# EAGLE design arpie-fullsize (EAGLE 6.4)

## Sheet 1 of 2
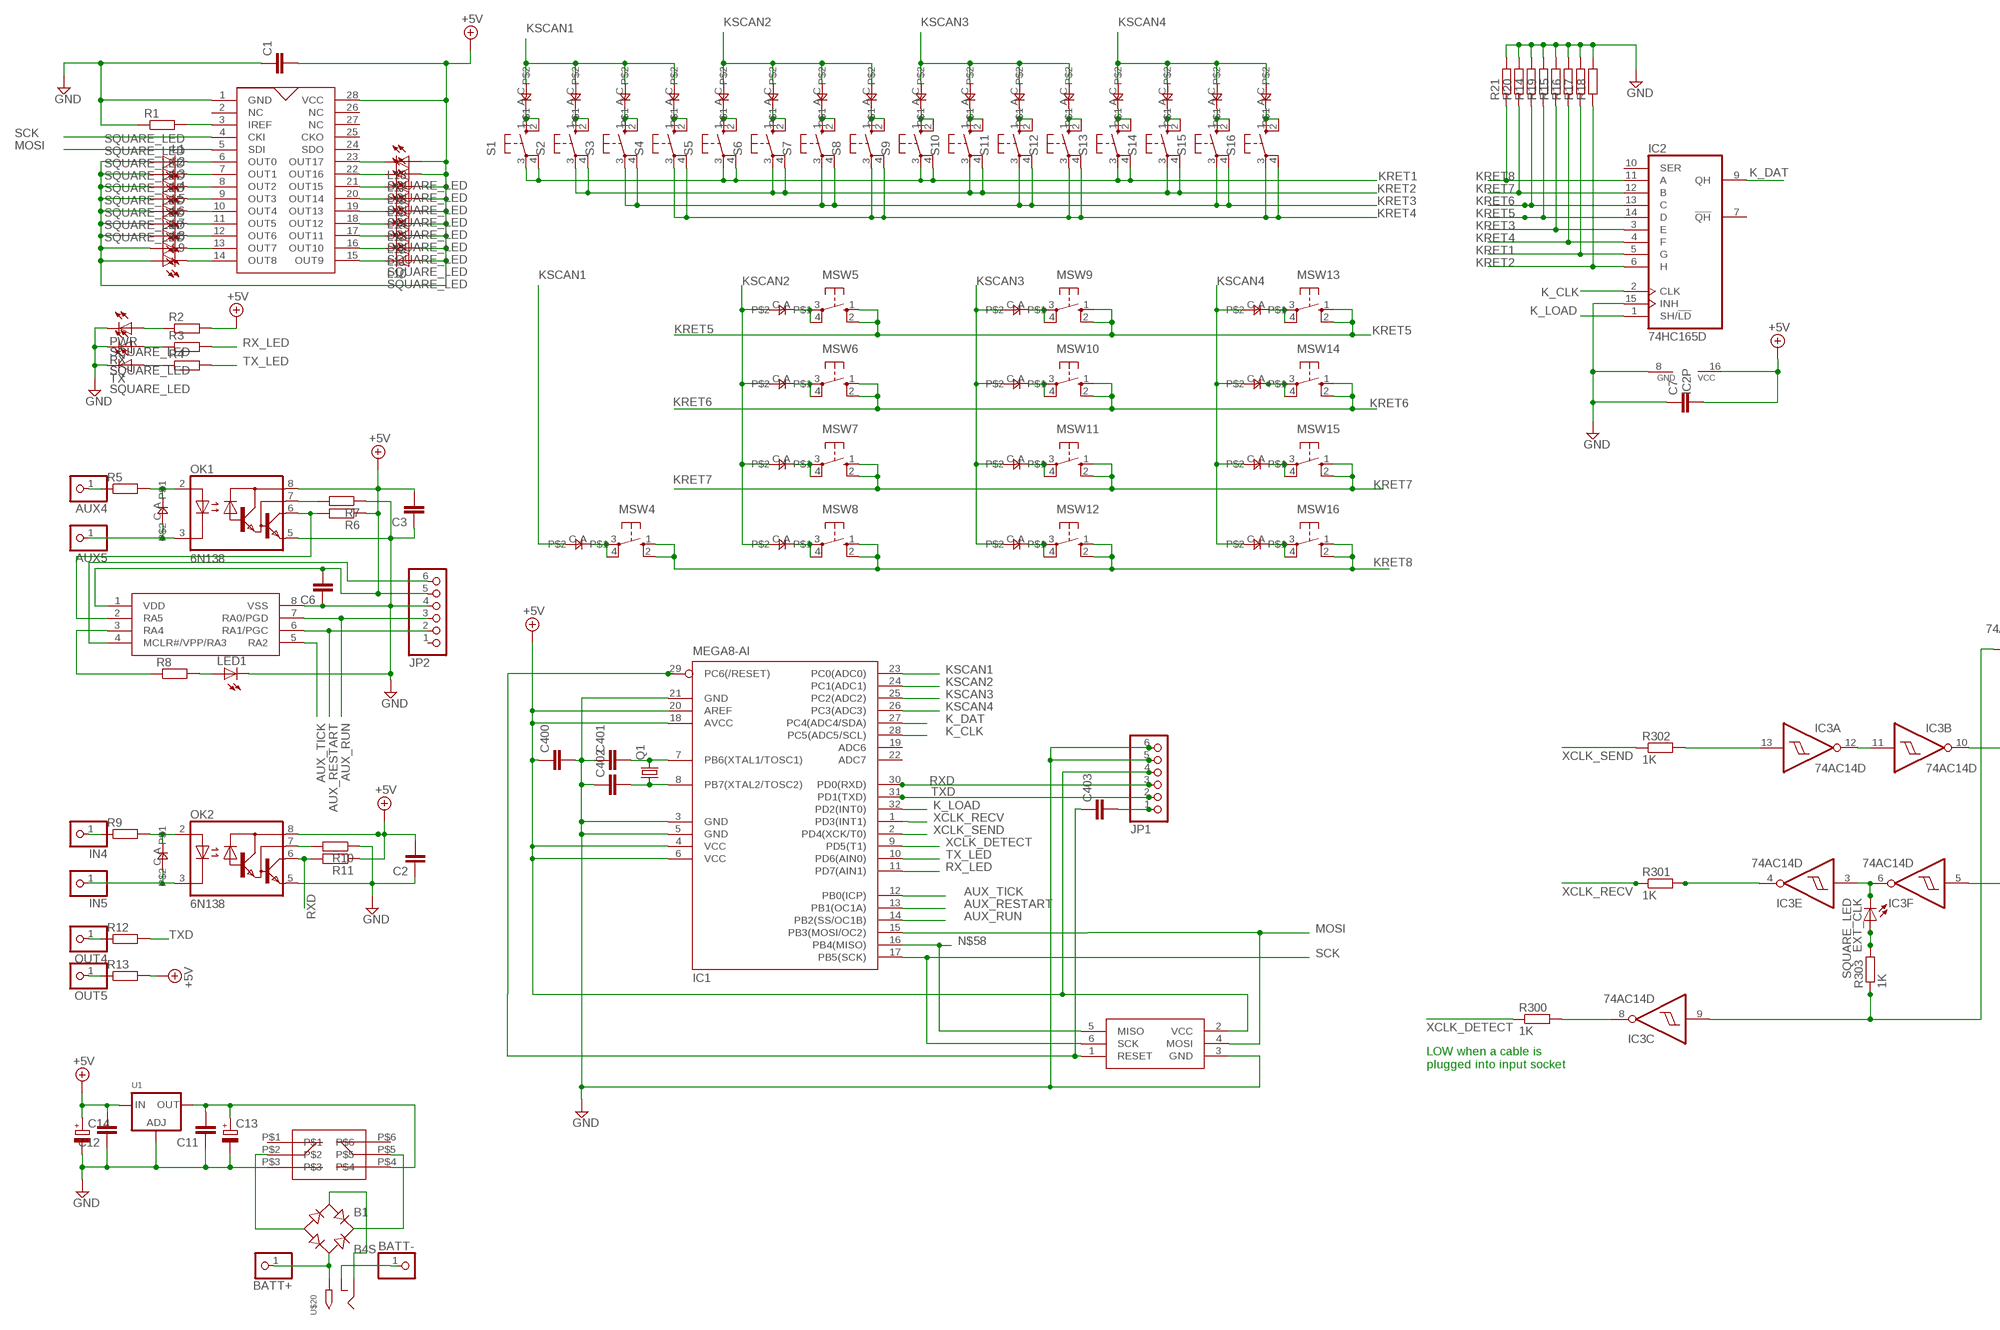
[diagram p0: schematic, sheet 1, part 1 of 2]
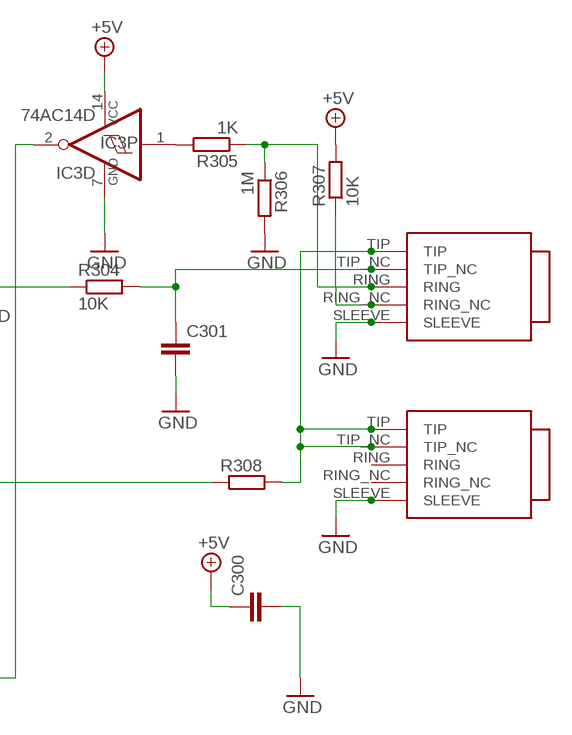
[diagram p1: schematic, sheet 1, part 2 of 2]

### Parts
AUX4  PINHD-1X1  [1X01]
AUX5  PINHD-1X1  [1X01]
B1  B4S  [MBS]
BATT+  PINHD-1X1  [1X01]
BATT-  PINHD-1X1  [1X01]
C1  C-EUC0805  [C0805]
C2  C-EUC0805  [C0805]
C3  C-EUC0805  [C0805]
C6  C-EUC0805  [C0805]
C7  C-EUC0805  [C0805]
C11  C-EUC0805  [C0805]
C12  C-EUC0805  [C0805]
C13  CPOL-EUE2-5  [E2-5]
C14  CPOL-EUE2-5  [E2-5]
C300  C-EUC0805  [C0805]
C301  C-EUC0805  [C0805]
C400  C-EUC0805  [C0805]
C401  C-EUC0805  [C0805]
C402  C-EUC0805  [C0805]
C403  C-EUC0805  [C0805]
EXT_CLK  SQUARE_LED  [RECT_LED]
IC1  MEGA8-AI  [TQFP32-08]
IC2  74HC165D  [SO16]
IC3  74AC14D  [SO14]
IN4  PINHD-1X1  [1X01]
IN5  PINHD-1X1  [1X01]
JP1  PINHD-1X6  [1X06]
JP2  PINHD-1X6  [1X06]
L1  SQUARE_LED  [RECT_LED]
L2  SQUARE_LED  [RECT_LED]
L3  SQUARE_LED  [RECT_LED]
L4  SQUARE_LED  [RECT_LED]
L5  SQUARE_LED  [RECT_LED]
L6  SQUARE_LED  [RECT_LED]
L7  SQUARE_LED  [RECT_LED]
L8  SQUARE_LED  [RECT_LED]
L9  SQUARE_LED  [RECT_LED]
L10  SQUARE_LED  [RECT_LED]
L11  SQUARE_LED  [RECT_LED]
L12  SQUARE_LED  [RECT_LED]
L13  SQUARE_LED  [RECT_LED]
L14  SQUARE_LED  [RECT_LED]
L15  SQUARE_LED  [RECT_LED]
L16  SQUARE_LED  [RECT_LED]
L17  SQUARE_LED  [RECT_LED]
L18  SQUARE_LED  [RECT_LED]
LED1  LEDCHIP-LED0805  [CHIP-LED0805]
MSW4  40-XX  [B3F-40XX]
MSW5  40-XX  [B3F-40XX]
MSW6  40-XX  [B3F-40XX]
MSW7  40-XX  [B3F-40XX]
MSW8  40-XX  [B3F-40XX]
MSW9  40-XX  [B3F-40XX]
MSW10  40-XX  [B3F-40XX]
MSW11  40-XX  [B3F-40XX]
MSW12  40-XX  [B3F-40XX]
MSW13  40-XX  [B3F-40XX]
MSW14  40-XX  [B3F-40XX]
MSW15  40-XX  [B3F-40XX]
MSW16  40-XX  [B3F-40XX]
OK1  6N138  [DIL08]
OK2  6N138  [DIL08]
OUT4  PINHD-1X1  [1X01]
OUT5  PINHD-1X1  [1X01]
PWR  SQUARE_LED  [RECT_LED]
Q1  CRYSTALHC49U-V  [HC49U-V]
R1  R-EU_R0805  [R0805]
R2  R-EU_R0805  [R0805]
R3  R-EU_R0805  [R0805]
R4  R-EU_R0805  [R0805]
R5  R-EU_R0805  [R0805]
R6  R-EU_R0805  [R0805]
R7  R-EU_R0805  [R0805]
R8  R-EU_R0805  [R0805]
R9  R-EU_R0805  [R0805]
R10  R-EU_R0805  [R0805]
R11  R-EU_R0805  [R0805]
R12  R-EU_R0805  [R0805]
R13  R-EU_R0805  [R0805]
R14  R-EU_R0805  [R0805]
R15  R-EU_R0805  [R0805]
R16  R-EU_R0805  [R0805]
R17  R-EU_R0805  [R0805]
R18  R-EU_R0805  [R0805]
R19  R-EU_R0805  [R0805]
R20  R-EU_R0805  [R0805]
R21  R-EU_R0805  [R0805]
R300  1K  R-EU_R0805  [R0805]
R301  1K  R-EU_R0805  [R0805]
R302  1K  R-EU_R0805  [R0805]
R303  1K  R-EU_R0805  [R0805]
R304  10K  R-EU_R0805  [R0805]
R305  1K  R-EU_R0805  [R0805]
R306  1M  R-EU_R0805  [R0805]
R307  10K  R-EU_R0805  [R0805]
R308  R-EU_R0805  [R0805]
RX  SQUARE_LED  [RECT_LED]
S1  10-XX  [B3F-10XX]
S2  10-XX  [B3F-10XX]
S3  10-XX  [B3F-10XX]
S4  10-XX  [B3F-10XX]
S5  10-XX  [B3F-10XX]
S6  10-XX  [B3F-10XX]
S7  10-XX  [B3F-10XX]
S8  10-XX  [B3F-10XX]
S9  10-XX  [B3F-10XX]
S10  10-XX  [B3F-10XX]
S11  10-XX  [B3F-10XX]
S12  10-XX  [B3F-10XX]
S13  10-XX  [B3F-10XX]
S14  10-XX  [B3F-10XX]
S15  10-XX  [B3F-10XX]
S16  10-XX  [B3F-10XX]
TX  SQUARE_LED  [RECT_LED]
U1  LM1117SOT223-REFLOW  [SOT223-R]
U$1  WS2803  [SO28W]
U$2  0805DIODE  [0805DIODE]
U$3  0805DIODE  [0805DIODE]
U$4  0805DIODE  [0805DIODE]
U$5  0805DIODE  [0805DIODE]
U$6  0805DIODE  [0805DIODE]
U$7  0805DIODE  [0805DIODE]
U$8  0805DIODE  [0805DIODE]
U$9  0805DIODE  [0805DIODE]
U$10  0805DIODE  [0805DIODE]
U$11  0805DIODE  [0805DIODE]
U$12  0805DIODE  [0805DIODE]
U$13  0805DIODE  [0805DIODE]
U$14  0805DIODE  [0805DIODE]
U$15  0805DIODE  [0805DIODE]
U$16  0805DIODE  [0805DIODE]
U$17  0805DIODE  [0805DIODE]
U$18  TRUCONNECTJACK  [TRUCONNECTJACK]
U$19  TRUCONNECTJACK  [TRUCONNECTJACK]
U$20  2.1MMJACKTHM  [PJ-102A]
U$21  0805DIODE  [0805DIODE]
U$22  0805DIODE  [0805DIODE]
U$23  0805DIODE  [0805DIODE]
U$24  0805DIODE  [0805DIODE]
U$25  0805DIODE  [0805DIODE]
U$26  0805DIODE  [0805DIODE]
U$27  0805DIODE  [0805DIODE]
U$28  0805DIODE  [0805DIODE]
U$29  0805DIODE  [0805DIODE]
U$30  0805DIODE  [0805DIODE]
U$31  0805DIODE  [0805DIODE]
U$32  0805DIODE  [0805DIODE]
U$33  0805DIODE  [0805DIODE]
U$34  TAG_CONN_AVR  [TC2030-MCP-NL]
U$35  PIC12F1822SO08  [SO08]
U$36  0805DIODE  [0805DIODE]
U$37  0805DIODE  [0805DIODE]
U$38  2P2T_LATCHING  [2P2T_LATCHING]

### Nets
+5V: C1.2 C2.2 C3.2 C6.2 C7.2 C12.2 C14.+ C300.1 C400.1 IC1.4(VCC) IC1.6(VCC) IC1.18(AVCC) IC1.20(AREF) IC2.16(VCC) IC3.14(P:VCC) JP1.4 JP2.5 L1.AN(A) L2.AN(A) L3.AN(A) L4.AN(A) L5.AN(A) L6.AN(A) L7.AN(A) L8.AN(A) L9.AN(A) L10.AN(A) L11.AN(A) L12.AN(A) L13.AN(A) L14.AN(A) L15.AN(A) L16.AN(A) L17.AN(A) L18.AN(A) OK1.8(VCC) OK2.8(VCC) R2.2 R6.1 R11.1 R13.2 R307.2 U1.3(IN) U$1.28(VCC) U$34.2(VCC) U$35.1(VDD)
AUX_RESTART: IC1.13(PB1(OC1A)) JP2.2 U$35.6(RA1/PGC)
AUX_RUN: IC1.14(PB2(SS/OC1B)) JP2.3 U$35.7(RA0/PGD)
AUX_TICK: IC1.12(PB0(ICP)) U$35.5(RA2)
GND: C1.1 C2.1 C3.1 C6.1 C7.1 C11.1 C12.1 C13.- C14.- C300.2 C301.2 C400.2 C401.1 C402.1 IC1.3(GND) IC1.5(GND) IC1.21(GND) IC2.8(GND) IC2.15(INH) IC3.7(P:GND) JP1.5 JP1.6 JP2.4 LED1.C OK1.5(GND) OK2.5(GND) PWR.CA(C) R1.1 R7.1 R10.1 R14.2 R15.2 R16.2 R17.2 R18.2 R19.2 R20.2 R21.2 R306.2 RX.CA(C) TX.CA(C) U1.1(ADJ) U$1.1(GND) U$18.SLEEVE U$19.SLEEVE U$34.3(GND) U$35.8(VSS) U$38.P$3
K_CLK: IC1.28(PC5(ADC5/SCL)) IC2.2(CLK)
K_DAT: IC1.27(PC4(ADC4/SDA)) IC2.9(QH)
K_LOAD: IC1.32(PD2(INT0)) IC2.1(SH/!LD)
KRET1: IC2.5(G) R17.1 S1.3(P) S1.4(P1) S5.3(P) S5.4(P1) S9.3(P) S9.4(P1) S13.3(P) S13.4(P1)
KRET2: IC2.6(H) R18.1 S2.3(P) S2.4(P1) S6.3(P) S6.4(P1) S10.3(P) S10.4(P1) S14.3(P) S14.4(P1)
KRET3: IC2.3(E) R15.1 S3.3(P) S3.4(P1) S7.3(P) S7.4(P1) S11.3(P) S11.4(P1) S15.3(P) S15.4(P1)
KRET4: IC2.4(F) R16.1 S4.3(P) S4.4(P1) S8.3(P) S8.4(P1) S12.3(P) S12.4(P1) S16.3(P) S16.4(P1)
KRET5: IC2.14(D) MSW5.1(S) MSW5.2(S1) MSW9.1(S) MSW9.2(S1) MSW13.1(S) MSW13.2(S1) R19.1
KRET6: IC2.13(C) MSW6.1(S) MSW6.2(S1) MSW10.1(S) MSW10.2(S1) MSW14.1(S) MSW14.2(S1) R14.1
KRET7: IC2.12(B) MSW7.1(S) MSW7.2(S1) MSW11.1(S) MSW11.2(S1) MSW15.1(S) MSW15.2(S1) R20.1
KRET8: IC2.11(A) MSW4.1(S) MSW4.2(S1) MSW8.1(S) MSW8.2(S1) MSW12.1(S) MSW12.2(S1) MSW16.1(S) MSW16.2(S1) R21.1
KSCAN1: IC1.23(PC0(ADC0)) U$2.C U$3.C U$4.C U$5.C U$21.C
KSCAN2: IC1.24(PC1(ADC1)) U$6.C U$7.C U$8.C U$9.C U$22.C U$23.C U$24.C U$25.C
KSCAN3: IC1.25(PC2(ADC2)) U$10.C U$11.C U$12.C U$13.C U$26.C U$27.C U$28.C U$29.C
KSCAN4: IC1.26(PC3(ADC3)) U$14.C U$15.C U$16.C U$17.C U$30.C U$31.C U$32.C U$33.C
MOSI: IC1.15(PB3(MOSI/OC2)) U$1.5(SDI) U$34.4(MOSI)
N$1: L1.CA(C) U$1.6(OUT0)
N$2: L2.CA(C) U$1.7(OUT1)
N$3: L3.CA(C) U$1.8(OUT2)
N$4: L4.CA(C) U$1.9(OUT3)
N$5: L5.CA(C) U$1.10(OUT4)
N$6: L6.CA(C) U$1.11(OUT5)
N$7: L7.CA(C) U$1.12(OUT6)
N$8: L8.CA(C) U$1.13(OUT7)
N$9: L9.CA(C) U$1.14(OUT8)
N$10: L18.CA(C) U$1.23(OUT17)
N$11: L17.CA(C) U$1.22(OUT16)
N$12: L16.CA(C) U$1.21(OUT15)
N$13: L15.CA(C) U$1.20(OUT14)
N$14: L14.CA(C) U$1.19(OUT13)
N$15: L13.CA(C) U$1.18(OUT12)
N$16: L12.CA(C) U$1.17(OUT11)
N$17: L11.CA(C) U$1.16(OUT10)
N$18: L10.CA(C) U$1.15(OUT9)
N$19: S1.1(S) S1.2(S1) U$2.A
N$20: S2.1(S) S2.2(S1) U$3.A
N$21: R1.2 U$1.3(IREF)
N$22: S3.1(S) S3.2(S1) U$4.A
N$23: S4.1(S) S4.2(S1) U$5.A
N$24: S5.1(S) S5.2(S1) U$6.A
N$25: S6.1(S) S6.2(S1) U$7.A
N$26: S7.1(S) S7.2(S1) U$8.A
N$27: S8.1(S) S8.2(S1) U$9.A
N$28: S9.1(S) S9.2(S1) U$10.A
N$29: S10.1(S) S10.2(S1) U$11.A
N$30: S11.1(S) S11.2(S1) U$12.A
N$31: S12.1(S) S12.2(S1) U$13.A
N$32: S13.1(S) S13.2(S1) U$14.A
N$33: S14.1(S) S14.2(S1) U$15.A
N$34: S15.1(S) S15.2(S1) U$16.A
N$35: S16.1(S) S16.2(S1) U$17.A
N$36: MSW13.3(P) MSW13.4(P1) U$30.A
N$38: MSW14.3(P) MSW14.4(P1) U$31.A
N$39: MSW16.3(P) MSW16.4(P1) U$33.A
N$40: MSW15.3(P) MSW15.4(P1) U$32.A
N$43: MSW4.3(P) MSW4.4(P1) U$21.A
N$44: MSW5.3(P) MSW5.4(P1) U$22.A
N$45: MSW6.3(P) MSW6.4(P1) U$23.A
N$46: MSW7.3(P) MSW7.4(P1) U$24.A
N$47: MSW8.3(P) MSW8.4(P1) U$25.A
N$48: MSW9.3(P) MSW9.4(P1) U$26.A
N$49: MSW10.3(P) MSW10.4(P1) U$27.A
N$50: MSW11.3(P) MSW11.4(P1) U$28.A
N$51: MSW12.3(P) MSW12.4(P1) U$29.A
N$52: C401.2 IC1.7(PB6(XTAL1/TOSC1)) Q1.2
N$53: C402.2 IC1.8(PB7(XTAL2/TOSC2)) Q1.1
N$54: PWR.AN(A) R2.1
N$55: R3.1 RX.AN(A)
N$56: R4.1 TX.AN(A)
N$57: OUT4.1 R12.1
N$58: IC1.16(PB4(MISO)) U$34.5(MISO)
N$60: OUT5.1 R13.1
N$61: C403.2 JP1.1
N$62: AUX4.1 R5.1
N$63: OK1.2(A) R5.2 U$36.A
N$64: AUX5.1 OK1.3(C) U$36.C
N$65: JP2.6 U$35.4(MCLR#/VPP/RA3)
N$66: IN4.1 R9.1
N$67: OK2.2(A) R9.2 U$37.A
N$68: IN5.1 OK2.3(C) U$37.C
N$70: OK1.7(VB) R7.2
N$71: OK1.6(VO) R6.2 U$35.2(RA5)
N$72: OK2.7(VB) R10.2
N$73: R8.1 U$35.3(RA4)
N$74: LED1.A R8.2
N$83: R308.2 U$18.TIP U$19.TIP U$19.TIP_NC
N$84: C301.1 R304.2 U$18.TIP_NC
N$85: IC3.10(B:O) R304.1
N$86: IC3.11(B:I) IC3.12(A:O)
N$87: IC3.13(A:I) R302.2
N$88: R307.1 U$18.RING_NC
N$89: R305.1 R306.1 U$18.RING
N$90: IC3.1(D:I) R305.2
N$91: EXT_CLK.CA(C) IC3.3(E:I) IC3.6(F:O)
N$92: IC3.5(F:I) R308.1
N$93: IC3.4(E:O) R301.2
N$94: IC3.2(D:O) IC3.9(C:I) R303.1
N$95: EXT_CLK.AN(A) R303.2
N$96: IC3.8(C:O) R300.2
N$98: BATT-.1 U$20.RING_SW
N$100: B1.AC2 BATT+.1 U$20.TIP
N$101: B1.- U$38.P$2
N$102: B1.+ U$38.P$5
N$105: C11.2 C13.+ U1.2(OUT) U$38.P$4
N$106: B1.AC1 U$20.RING
RESET: C403.1 IC1.29(PC6(/RESET)) U$34.1(RESET)
RX_LED: IC1.11(PD7(AIN1)) R3.2
RXD: IC1.30(PD0(RXD)) JP1.3 OK2.6(VO) R11.2
SCK: IC1.17(PB5(SCK)) U$1.4(CKI) U$34.6(SCK)
TX_LED: IC1.10(PD6(AIN0)) R4.2
TXD: IC1.31(PD1(TXD)) JP1.2 R12.2
XCLK_DETECT: IC1.9(PD5(T1)) R300.1
XCLK_RECV: IC1.1(PD3(INT1)) R301.1
XCLK_SEND: IC1.2(PD4(XCK/T0)) R302.1
Unconnected: IC1.19(ADC6) IC1.22(ADC7) IC2.7(!QH) IC2.10(SER) JP2.1 U$1.2(NC) U$1.24(SDO) U$1.25(CKO) U$1.26(NC) U$1.27(NC) U$19.RING U$19.RING_NC U$38.P$1 U$38.P$6

### Notes on the sheet
- LOW when a cable is 
  plugged into input socket

## Sheet 2 of 2

## Library data of the parts
AUX4 AUX5 BATT+ BATT- IN4 IN5 OUT4 OUT5 = pinhead:PINHD-1X1: PIN HEADER
B1 = rectifier:B*S: Surface Mount Glass Passivated Bridge Rectifiers Source: Comchip Bridge Rectifiers B05S-G_B10S-G.pdf
C1-C3 C6 C7 C11 C12 C400-C403 = resistor:C-EU: CAPACITOR, European symbol
C13 C14 = rcl:CPOL-EU: POLARIZED CAPACITOR, European symbol
C300 C301 = rcl:C-EU: CAPACITOR, European symbol
EXT_CLK L1-L18 PWR RX TX = jasons_stuff:SQUARE_LED
IC1 = atmel:MEGA8: MICROCONTROLLER 8 Kbytes FLASH, 1 kbytes SRAM, 512 bytes EEPROM, USART, 6-channel 10 bit ADC, 2-channel 8 bit ADC Pin compatible with Atmega48, ATMega88, ATMega168 Source: avr.lbr
IC2 = 74xx-eu:74*165: 8-bit parallel load SHIFT REGISTER
IC3 = 74xx-eu:74*14: Hex schmitt trigger INVERTER
JP1 JP2 = pinhead:PINHD-1X6: PIN HEADER
LED1 = led:LED: LED OSRAM: - CHIPLED LG R971, LG N971, LY N971, LG Q971, LY Q971, LO R971, LY R971 LH N974, LH R974 LS Q976, LO Q976, LY Q976 LO Q996 - Hyper CHIPLED LW Q18S LB Q993, LB Q99A, LB R99A - SideLED LS A670, LO A670, LY A670, LG A670, LP A670 LB A673, LV A673, LT A673, LW A673 LH A674 LY A675 LS A676, LA A676, LO A676, LY A676, LW A676 LS A679, LY A679, LG A679 - Hyper Micro SIDELED® LS Y876, LA Y876, LO Y876, LY Y876 LT Y87S - SmartLED LW L88C, LW L88S LB L89C, LB L89S, LG L890 LS L89K, LO L89K, LY L89K LS L896, LA L896, LO L896, LY L896 - TOPLED LS T670, LO T670, LY T670, LG T670, LP T670 LSG T670, LSP T670, LSY T670, LOP T670, LYG T670 LG T671, LOG T671, LSG T671 LB T673, LV T673, LT T673, LW T673 LH T674 LS T676, LA T676, LO T676, LY T676, LB T676, LH T676, LSB T676, LW T676 LB T67C, LV T67C, LT T67C, LS T67K, LO T67K, LY T67K, LW E67C LS E67B, LA E67B, LO E67B, LY E67B, LB E67C, LV E67C, LT E67C LW T67C LS T679, LY T679, LG T679 LS T770, LO T770, LY T770, LG T770, LP T770 LB T773, LV T773, LT T773, LW T773 LH T774 LS E675, LA E675, LY E675, LS T675 LS T776, LA T776, LO T776, LY T776, LB T776 LHGB T686 LT T68C, LB T68C - Hyper Mini TOPLED® LB M676 - Mini TOPLED Santana® LG M470 LS M47K, LO M47K, LY M47K Source: http://www.osram.convergy.de LUXEON: - LUMILED® LXK2-PW12-R00, LXK2-PW12-S00, LXK2-PW14-U00, LXK2-PW14-V00 LXK2-PM12-R00, LXK2-PM12-S00, LXK2-PM14-U00 LXK2-PE12-Q00, LXK2-PE12-R00, LXK2-PE12-S00, LXK2-PE14-T00, LXK2-PE14-U00 LXK2-PB12-K00, LXK2-PB12-L00, LXK2-PB12-M00, LXK2-PB14-N00, LXK2-PB14-P00, LXK2-PB14-Q00 LXK2-PR12-L00, LXK2-PR12-M00, LXK2-PR14-Q00, LXK2-PR14-R00 LXK2-PD12-Q00, LXK2-PD12-R00, LXK2-PD12-S00 LXK2-PH12-R00, LXK2-PH12-S00 LXK2-PL12-P00, LXK2-PL12-Q00, LXK2-PL12-R00 Source: www.luxeon.com KINGBRIGHT: KA-3528ASYC Source: www.kingbright.com
MSW4-MSW16 = switch-omron:40-XX: OMRON SWITCH
OK1 OK2 = optocoupler:6N138: MOTOROLA OPTO COUPLER
Q1 = crystal:CRYSTAL: CRYSTAL
R1-R21 = resistor:R-EU_: RESISTOR, European symbol
R300-R308 = rcl:R-EU_: RESISTOR, European symbol
S1-S16 = switch-omron:10-XX: OMRON SWITCH
U1 = microbuilder:LM1117: LM1117 Voltage Regulator LM1117 Adjustable Voltage regulator [Digikey: LM1117IMP-ADJDKR-ND] LM1117 3.3V Voltage regulator [AP1117E33GDIDKR-ND] LM1117 5.0V Voltage regulator [AP1117E50GDIDKR-ND] SOT223-REFLOW - SOT223 package for solder paste/reflow ovens SOT223-WAVE - SOT223 package for hand-soldering (larger pads) Note: For the fixed-voltage regulators, simply set the ADJ pin to GND.
U$1 = jasons_stuff:WS2803
U$2-U$17 U$21-U$33 U$36 U$37 = jasons_stuff:0805DIODE
U$18 U$19 = jason_eagle6:TRUCONNECTJACK
U$20 = adafruit:2.1MMJACK: 2.1mm x 5.5mm THM DC jack with internal switch. Digikey part #PJ-102A, 4UCON part #05537 2.1mm x 5.5mm SMT DC jack with internal switch. Digikey part #PJ-002A-SMT, 4UCON part #03267 By microbuilder.eu & adafruit.com
U$34 = jasons_stuff:TAG_CONN_AVR
U$35 = jasons_stuff:PIC12F1822
U$38 = jasons_stuff:2P2T_LATCHING

## Board
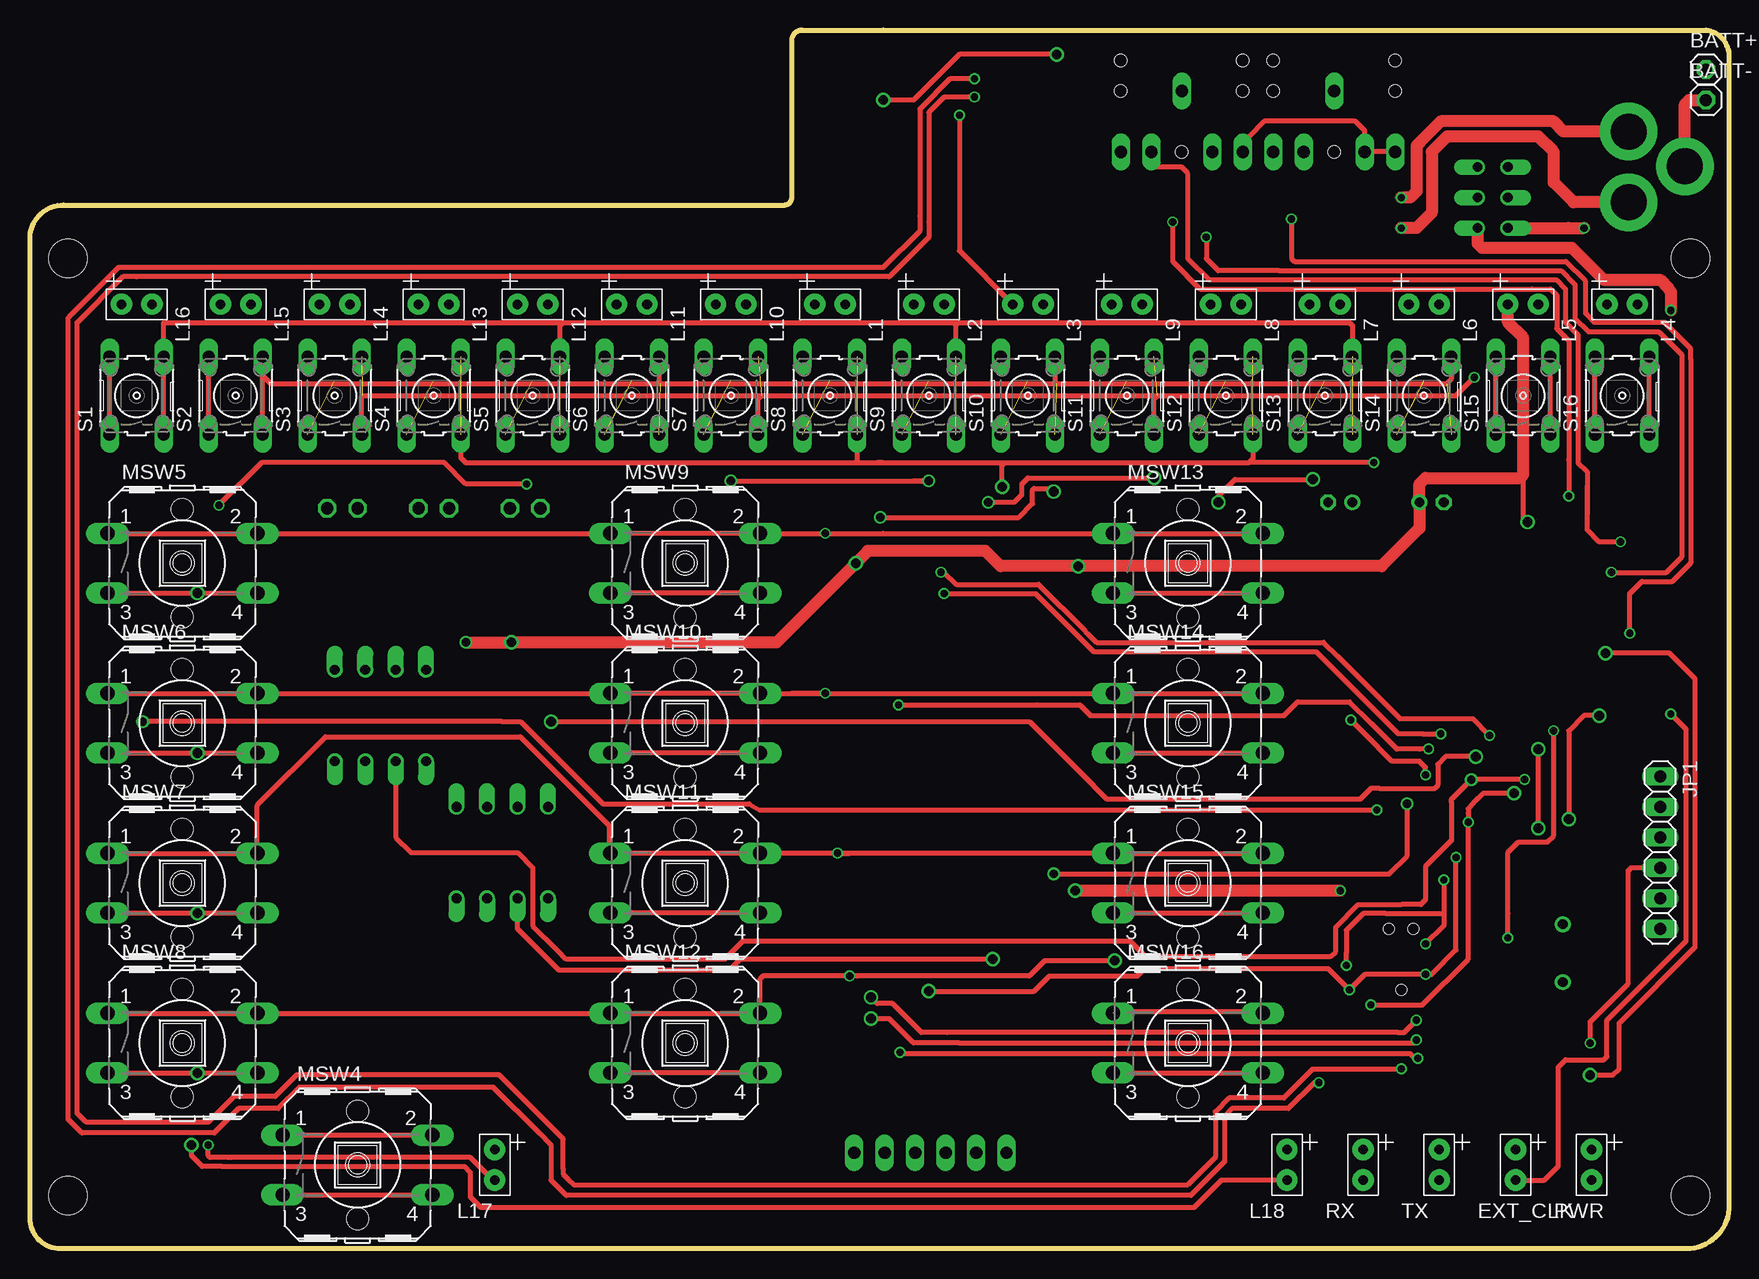
[diagram p2: board, top side]
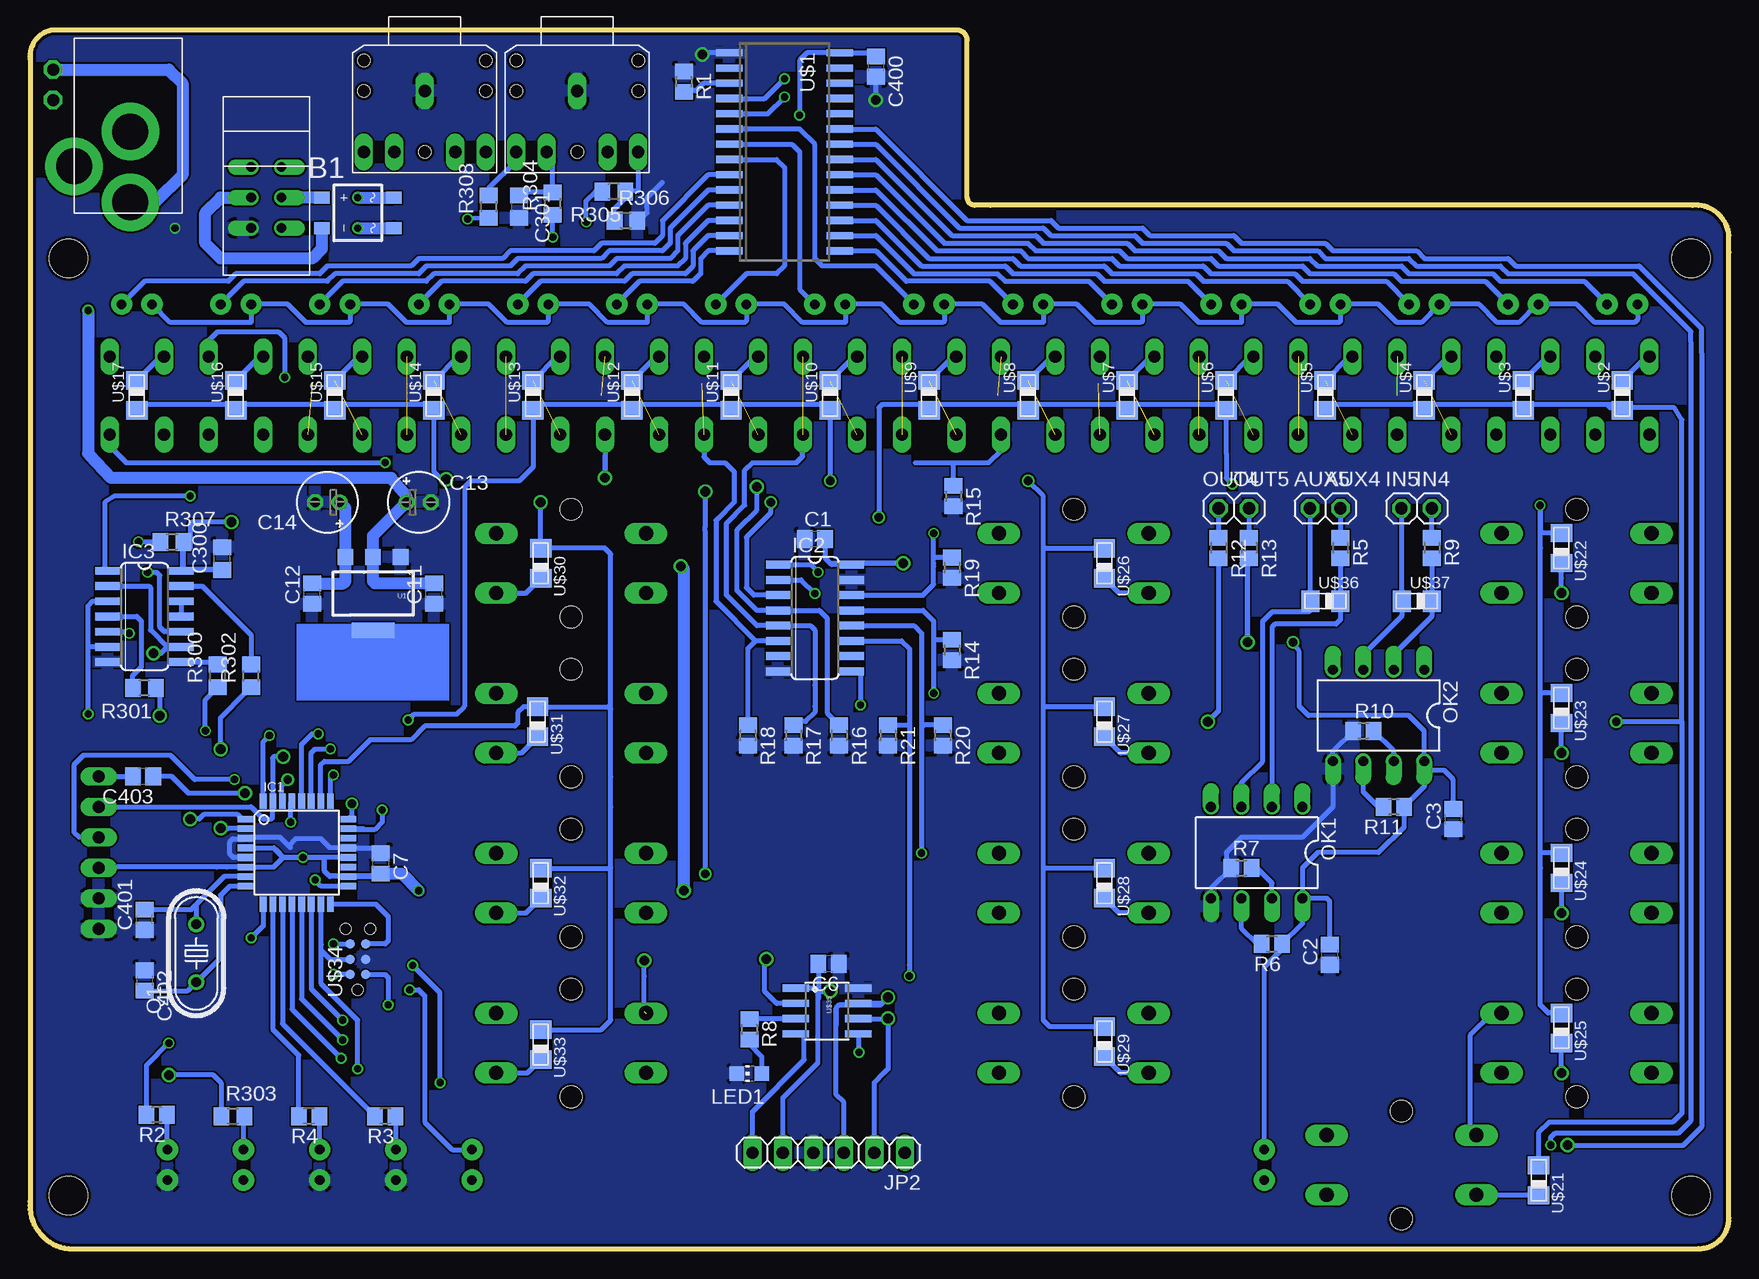
[diagram p3: board, bottom side, seen from below]

Size 141.62 x 101.6 mm. Coordinates in mm from the lower left corner, seen from the top.
Outline: 71.12,101.6 139.7,101.6 arc-90 141.61,99.19 141.61,3.94 arc-90 138.43,0 2.54,0 arc-90 0,2.54 0,83.06 0,84.45 arc-90 3.05,87 61.6,87 62.87,87 arc90 63.5,87.63 63.5,100.71 arc-90 64.39,101.6 71.12,101.6
Copper layers (1*16): Top 0.035mm / dielectric 1.5mm / Bottom 0.035mm
Design rules "ITEADstudio_DRC": minimum track width 6mil, minimum drill 12mil, track to track 6mil, track to pad 6mil, pad to pad 6mil, via to via 6mil, smd to smd 0mil, copper to edge 10mil, drill to drill 10mil, minimum pad ring 10mil, minimum via ring 6mil, stop-mask expansion 2mil, vias tented up to drill 100mil, thermal gap 10mil
Holes 3.2 mm at 3.17,4.45 138.43,4.45 3.17,82.55 138.43,82.55

### Footprints (pad centres in the part's own frame; a part is rotated, then mirrored left to right if it is on the bottom)
1X01 = drill 1.016 octagon: 1 0,0
MBS = smd 1 x 1.3: + -1.27,-3; - 1.27,-3; AC1 -1.27,3; AC2 1.27,3
C0805 = smd 1.3 x 1.5: 1 -0.85,0; 2 0.85,0
E2-5 = drill 0.813 pad 1.27: + -1.016,0 | drill 0.813 pad 1.27 octagon: - 1.016,0
C0805' = smd 1.3 x 1.5: 1 -0.95,0; 2 0.95,0
RECT_LED = drill 0.8 pad 1.778: AN 0,1.27; CA 0,-1.27
TQFP32-08 = smd 1.27 x 0.559: 1 -4.293,2.8; 2 -4.293,2; 3 -4.293,1.2; 4 -4.293,0.4; 5 -4.293,-0.4; 6 -4.293,-1.2; 7 -4.293,-2; 8 -4.293,-2.8; 17 4.293,-2.8; 18 4.293,-2; 19 4.293,-1.2; 20 4.293,-0.4; 21 4.293,0.4; 22 4.293,1.2; 23 4.293,2; 24 4.293,2.8 | smd 0.559 x 1.27: 9 -2.8,-4.293; 10 -2,-4.293; 11 -1.2,-4.293; 12 -0.4,-4.293; 13 0.4,-4.293; 14 1.2,-4.293; 15 2,-4.293; 16 2.8,-4.293; 25 2.8,4.293; 26 2,4.293; 27 1.2,4.293; 28 0.4,4.293; 29 -0.4,4.293; 30 -1.2,4.293; 31 -2,4.293; 32 -2.8,4.293
SO16 = smd 0.66 x 2.032: 1 -4.445,-3.073; 2 -3.175,-3.073; 3 -1.905,-3.073; 4 -0.635,-3.073; 5 0.635,-3.073; 6 1.905,-3.073; 7 3.175,-3.073; 8 4.445,-3.073; 9 4.445,3.073; 10 3.175,3.073; 11 1.905,3.073; 12 0.635,3.073; 13 -0.635,3.073; 14 -1.905,3.073; 15 -3.175,3.073; 16 -4.445,3.073
SO14 = smd 0.66 x 2.032: 1 -3.81,-3.073; 2 -2.54,-3.073; 3 -1.27,-3.073; 4 0,-3.073; 5 1.27,-3.073; 6 2.54,-3.073; 7 3.81,-3.073; 8 3.81,3.073; 9 2.54,3.073; 10 1.27,3.073; 11 0,3.073; 12 -1.27,3.073; 13 -2.54,3.073; 14 -3.81,3.073
1X06 = drill 1.016 long: 1 -6.35,0; 2 -3.81,0; 3 -1.27,0; 4 1.27,0; 5 3.81,0; 6 6.35,0
CHIP-LED0805 = smd 1.2 x 1.2: A 0,-1.05; C 0,1.05
B3F-40XX = drill 1.194 long: 1 -6.248,2.489; 2 6.248,2.489; 3 -6.248,-2.489; 4 6.248,-2.489 | hole 1.803: 0,-4.496; 0,4.496
DIL08 = drill 0.813 offset: 1 -3.81,-3.81; 2 -1.27,-3.81; 3 1.27,-3.81; 4 3.81,-3.81; 5 3.81,3.81; 6 1.27,3.81; 7 -1.27,3.81; 8 -3.81,3.81
HC49U-V = drill 0.813: 1 -2.413,0; 2 2.413,0
R0805 = smd 1.3 x 1.5: 1 -0.85,0; 2 0.85,0
R0805' = smd 1.3 x 1.5: 1 -0.95,0; 2 0.95,0
B3F-10XX = drill 1.016 long: 1 -3.251,2.261; 2 3.251,2.261; 3 -3.251,-2.261; 4 3.251,-2.261
SOT223-R = smd 1.3 x 1.3: 1 -2.3,-3.05; 2 0,-3.05; 3 2.3,-3.05 | smd 3.6 x 1.3: 4 0,3.05
SO28W = smd 0.6 x 2.2: 1 -8.255,-4.6; 2 -6.985,-4.6; 3 -5.715,-4.6; 4 -4.445,-4.6; 5 -3.175,-4.6; 6 -1.905,-4.6; 7 -0.635,-4.6; 8 0.635,-4.6; 9 1.905,-4.6; 10 3.175,-4.6; 11 4.445,-4.6; 12 5.715,-4.6; 13 6.985,-4.6; 14 8.255,-4.6; 15 8.255,4.6; 16 6.985,4.6; 17 5.715,4.6; 18 4.445,4.6; 19 3.175,4.6; 20 1.905,4.6; 21 0.635,4.6; 22 -0.635,4.6; 23 -1.905,4.6; 24 -3.175,4.6; 25 -4.445,4.6; 26 -5.715,4.6; 27 -6.985,4.6; 28 -8.255,4.6
0805DIODE = smd 1.524 x 1.778: A -1.262,-0.005; C 1.238,-0.005
TRUCONNECTJACK = drill 1.016 long: RING -1.27,-5.08; RING_NC -1.27,-2.54; SLEEVE 3.81,0; TIP -1.27,5.08; TIP_NC -1.27,2.54 | hole 1.016: 3.81,5.08; 6.35,5.08; 3.81,-5.08; 6.35,-5.08; -1.27,0
PJ-102A = drill 3 pad 4.8: RING 0.1,-3.39; RING_SW -4.6,-6.29; TIP 0.1,-9.29
TC2030-MCP-NL = smd 0.787 x 0.787: 1 1.27,-0.635; 2 1.27,0.635; 3 2.54,-0.635; 4 2.54,0.635; 5 3.81,-0.635; 6 3.81,0.635 | hole 0.889: 0,0; 5.08,-1.016; 5.08,1.016
SO08 = smd 0.61 x 2.21: 1 -1.905,-2.616; 2 -0.635,-2.616; 3 0.635,-2.616; 4 1.905,-2.616; 5 1.905,2.616; 6 0.635,2.616; 7 -0.635,2.616; 8 -1.905,2.616
2P2T_LATCHING = drill 0.8 offset: P$1 -1.27,0; P$2 -1.27,-2.54; P$3 -1.27,-5.08; P$4 1.27,-5.08; P$5 1.27,-2.54; P$6 1.27,0

### Placement (x,y rotation side)
AUX4  32.38,61.72 0 bottom
AUX5  34.93,61.72 0 bottom
B1  114.3,86.36 270 bottom
BATT+  139.7,98.3 0 top
BATT-  139.7,95.76 0 top
C1  76.2,59.18 0 bottom
C2  33.27,24.51 90 bottom
C3  22.99,35.81 90 bottom
C6  75.06,23.75 180 bottom
C7  112.39,32.13 270 bottom
C11  107.95,54.61 90 bottom
C12  118.11,54.61 90 bottom
C13  109.22,62.23 0 bottom
C14  116.84,62.23 180 bottom
C300  [C0805']  125.6,57.53 90 bottom
C301  [C0805']  100.84,86.87 270 bottom
C400  71.12,98.55 270 bottom
C401  132.08,27.43 90 bottom
C402  132.08,22.35 270 bottom
C403  132.21,39.37 180 bottom
EXT_CLK  123.83,6.99 0 top
IC1  119.38,33.02 0 bottom
IC2  76.2,52.58 270 bottom
IC3  132.08,52.7 270 bottom
IN4  24.77,61.72 0 bottom
IN5  27.3,61.72 0 bottom
JP1  135.89,33.02 270 top
JP2  75.06,8 180 bottom
L1  66.67,78.74 90 top
L2  74.93,78.74 90 top
L3  83.19,78.74 90 top
L4  132.72,78.74 90 top
L5  124.46,78.74 90 top
L6  116.2,78.74 90 top
L7  107.95,78.74 90 top
L8  99.69,78.74 90 top
L9  91.44,78.74 90 top
L10  58.42,78.74 90 top
L11  50.17,78.74 90 top
L12  41.91,78.74 90 top
L13  33.66,78.74 90 top
L14  25.4,78.74 90 top
L15  17.14,78.74 90 top
L16  8.89,78.74 90 top
L17  38.74,6.99 0 top
L18  104.77,6.99 0 top
LED1  81.66,14.61 90 bottom
MSW4  27.3,6.99 0 top
MSW5  12.7,57.15 0 top
MSW6  12.7,43.81 0 top
MSW7  12.7,30.48 0 top
MSW8  12.7,17.14 0 top
MSW9  54.61,57.15 0 top
MSW10  54.61,43.81 0 top
MSW11  54.61,30.48 0 top
MSW12  54.61,17.14 0 top
MSW13  96.52,57.15 0 top
MSW14  96.52,43.81 0 top
MSW15  96.52,30.48 0 top
MSW16  96.52,17.14 0 top
OK1  39.37,33.02 180 bottom
OK2  29.21,44.45 180 bottom
OUT4  42.55,61.72 0 bottom
OUT5  40.01,61.72 0 bottom
PWR  130.18,6.99 0 top
Q1  127.76,24.64 90 bottom
R1  87.12,97.28 270 bottom
R2  131.06,11.18 180 bottom
R3  112.01,11.05 180 bottom
R4  118.36,11.05 180 bottom
R5  32.38,58.42 270 bottom
R6  38.1,25.4 180 bottom
R7  40.64,31.75 0 bottom
R8  81.66,18.29 270 bottom
R9  24.77,58.42 270 bottom
R10  30.48,43.18 0 bottom
R11  27.94,36.83 180 bottom
R12  42.55,58.42 270 bottom
R13  40.01,58.42 270 bottom
R14  64.77,49.91 270 bottom
R15  64.64,62.74 270 bottom
R16  74.17,42.8 270 bottom
R17  77.98,42.8 270 bottom
R18  81.79,42.8 270 bottom
R19  64.77,56.77 270 bottom
R20  65.53,42.8 270 bottom
R21  70.1,42.8 270 bottom
R300  1K  [R0805']  125.98,47.75 90 bottom
R301  1K  [R0805']  132.08,46.74 180 bottom
R302  1K  [R0805']  123.19,47.75 90 bottom
R303  1K  [R0805']  124.71,11.05 0 bottom
R304  10K  [R0805']  98.04,87.12 90 bottom
R305  1K  [R0805']  92.96,88.14 180 bottom
R306  1M  [R0805']  91.95,85.72 0 bottom
R307  10K  [R0805']  129.79,58.93 0 bottom
R308  [R0805']  103.38,86.87 90 bottom
RX  111.12,6.99 0 top
S1  8.89,71.12 90 top
S2  17.14,71.12 90 top
S3  25.4,71.12 90 top
S4  33.66,71.12 90 top
S5  41.91,71.12 90 top
S6  50.17,71.12 90 top
S7  58.42,71.12 90 top
S8  66.67,71.12 90 top
S9  74.93,71.12 90 top
S10  83.19,71.12 90 top
S11  91.44,71.12 90 top
S12  99.69,71.12 90 top
S13  107.95,71.12 90 top
S14  116.2,71.12 90 top
S15  124.46,71.12 90 top
S16  132.72,71.12 90 top
TX  117.47,6.99 0 top
U1  113.03,54.61 180 bottom
U$1  78.74,91.44 270 bottom
U$2  8.89,71.12 270 bottom
U$3  17.14,71.12 270 bottom
U$4  25.4,71.12 270 bottom
U$5  33.66,71.12 270 bottom
U$6  41.91,71.12 270 bottom
U$7  50.17,71.12 270 bottom
U$8  58.42,71.12 270 bottom
U$9  66.67,71.12 270 bottom
U$10  74.93,71.12 270 bottom
U$11  83.19,71.12 270 bottom
U$12  91.44,71.12 270 bottom
U$13  99.69,71.12 270 bottom
U$14  107.95,71.12 270 bottom
U$15  116.2,71.12 270 bottom
U$16  124.46,71.12 270 bottom
U$17  132.72,71.12 270 bottom
U$18  96.01,92.71 90 bottom
U$19  108.71,92.71 90 bottom
U$20  133.35,96.52 0 bottom
U$21  15.88,5.71 90 bottom
U$22  13.97,58.42 90 bottom
U$23  13.97,45.09 90 bottom
U$24  13.97,31.75 90 bottom
U$25  13.97,18.41 90 bottom
U$26  52.07,57.15 90 bottom
U$27  52.07,43.94 90 bottom
U$28  52.07,30.48 90 bottom
U$29  52.07,17.27 90 bottom
U$30  99.06,57.15 90 bottom
U$31  99.31,43.94 90 bottom
U$32  99.06,30.48 90 bottom
U$33  99.06,17.02 90 bottom
U$34  114.3,21.59 90 bottom
U$35  75.18,19.81 270 bottom
U$36  33.66,53.98 180 bottom
U$37  26.04,53.98 180 bottom
U$38  121.92,90.17 0 bottom

### Tracks (layer width: path | path; a pad name or v marks a point on that pad's centre or on a via)
+5V  (via drill 0.6, 0.7, 0.8)
  Top 0.406: L3.AN 77.47,83.19 v77.47,94.49 | v116.33,22.86 116.84,22.86 | 116.84,22.86 118.87,24.89 v118.87,32.62 | v74.93,21.46 83.69,21.46 84.96,22.73 92.33,22.73 92.58,22.99 92.96,23.37 99.95,23.37 108.2,23.37 109.6,21.97 v109.98,21.59 111.25,22.86 116.84,22.86 | 124.46,64.64 124.46,61.21 124.46,60.96 v124.84,60.58 | v130.05,17.14 130.05,18.92 133.22,22.1 133.22,31.5 133.48,31.75 JP1.4
  Top 1.016: L5.AN 123.19,77.22 124.46,75.95 124.46,64.64 124.46,64.52 124.21,64.26 116.33,64.26 115.82,63.75 C14.+ 115.82,60.07 112.65,56.9 87.63,56.9 | 87.63,56.9 v87.38,56.9 | v87.38,56.9 80.9,56.9 79.63,58.17 69.85,58.17 v68.83,57.15 62.23,50.55 40.39,50.55 v40.13,50.55 v36.32,50.55 | 105.41,29.84 v109.22,29.84 105.41,29.84 | 105.41,29.84 v87.12,29.84 | v87.38,56.9 87.63,56.9
  Bottom 0.406: 25.4,40.01 OK2.8 25.4,43.18 26.67,44.45 35.05,44.45 35.81,45.21 35.81,49.78 v36.32,50.55 | 25.4,40.01 25.4,38.52 R11.1 27.09,35.14 29.21,33.02 34.29,33.02 35.56,31.75 OK1.8 | OK1.8 35.56,27.94 | 35.56,27.94 35.56,27.09 R6.1 36.83,25.4 38.74,23.5 L17.AN | OK1.8 35.56,27.94 | 40.64,57.15 40.43,57.15 R13.2 | v77.47,94.49 77.47,99.06 76.83,99.69 U$1.28 71.41,99.69 C400.1 | 123.56,33.53 IC1.4 121.3,33.42 | IC1.20 117.09,32.62 | 117.09,32.62 v118.87,32.62 | v118.87,32.62 119.38,32.62 | 119.38,32.62 120.5,32.62 | 120.5,32.62 120.52,32.64 | 120.52,32.64 120.78,32.89 | 120.78,32.89 121.16,33.27 | 121.3,33.42 120.78,32.89 | 120.5,32.62 121.3,31.82 IC1.6 125.22,31.82 126.04,31.82 135.82,31.82 JP1.4 | 116.71,31.11 116.62,31.02 IC1.18 112.66,31.02 C7.2 | 116.71,31.11 117.09,31.5 | 117.09,31.5 117.09,32.62 | U$34.2 v116.33,22.86 | v118.87,32.62 119.38,32.62 | L16.AN 7.62,77.47 7.87,77.22 11.18,77.22 12.7,78.74 L15.AN 16,78.74 17.53,77.22 19.3,77.22 20.83,78.74 L14.AN 25.65,77.22 27.69,77.22 29.21,78.74 L13.AN 32.38,77.34 32.51,77.22 36.07,77.22 37.59,78.74 L12.AN 40.64,77.22 44.2,77.22 45.72,78.74 L11.AN 48.9,77.34 49.02,77.22 52.83,77.22 54.36,78.74 L10.AN 57.15,77.22 60.71,77.22 62.23,78.74 L1.AN 65.41,77.34 65.53,77.22 69.09,77.22 70.61,78.74 L2.AN 73.66,77.22 77.22,77.22 78.74,78.74 L3.AN 81.91,77.34 82.04,77.22 85.6,77.22 87.12,78.74 L9.AN 90.17,77.22 93.47,77.22 95,78.74 L8.AN 98.42,77.34 98.55,77.22 101.85,77.22 103.38,78.74 L7.AN 106.68,77.22 110.24,77.22 111.76,78.74 L6.AN 114.94,77.34 115.06,77.22 118.62,77.22 120.14,78.74 L5.AN 123.19,77.22 129.92,77.22 L4.AN
  Bottom 0.406: IC2.16 73.66,57.02 | 73.66,57.02 74.8,57.02 74.93,57.15 | 74.93,57.15 75.18,57.4 | 75.35,57.57 C1.2 75.35,57.57 | 75.35,57.57 75.18,57.4 | R307.2 128.84,58.42 | 128.84,58.42 128.84,56.68 | 128.84,56.68 IC3.14 128.88,56.64 | 40.13,57.15 v40.13,50.55 40.13,57.15 | 40.13,57.15 40.13,57.44 R13.2 | C12.2 118.62,55.46 115.99,55.46 115.57,55.88 115.57,55.5 | R13.2 40.01,57.28 40.13,57.15 | 73.66,57.02 73.53,57.15 v68.83,57.15 74.93,57.15 | 75.35,57.57 75.18,57.4 | 75.18,57.4 74.93,57.15 | JP2.5 78.87,12.57 75.95,15.49 75.95,20.83 | 75.95,20.83 75.95,21.34 76.33,21.72 U$35.1 | 75.95,20.83 75.91,20.87 C6.2 75.91,21.76 75.95,21.72 75.95,21.46 v74.93,21.46 | 128.84,56.68 126.01,56.68 C300.1 128.84,56.58 128.91,56.52 128.91,59.05 | v124.84,60.58 128.14,60.58 128.27,60.45 128.27,58.42 128.84,58.42 | L18.AN 106.43,8.26 108.71,10.54 108.71,21.08 109.22,21.59 v109.98,21.59 | 121.3,33.42 120.52,32.64 | 120.52,32.64 117.09,32.64 117.09,31.5 | 117.09,31.5 116.71,31.11 | 116.71,31.11 112.39,31.11 | C3.2 22.99,39.12 23.75,39.88 25.27,39.88 25.4,40.01 | C2.2 33.27,28.96 33.53,29.21 OK1.8 | R2.2 131.91,15.28 v130.05,17.14
  Bottom 1.016: C14.+ 115.33,61.74 U1.3 115.32,57.65 115.32,55.63 115.48,55.46 C12.2 | v87.12,29.84 87.12,56.64 v87.38,56.9 | C7.2 110.66,31.28 v109.22,29.84
AUX_RESTART  (via drill 0.6, 0.8)
  Top 0.406: 73.66,17.14 77.47,17.14 115.32,17.14 v115.57,17.4 | 73.66,17.14 71.63,19.18 | 71.63,19.18 v70.1,19.18 71.63,19.18 | 73.66,17.14 71.63,19.18
  Bottom 0.406: IC1.13 118.98,20.81 v115.57,17.4 | U$35.6 v70.1,19.18 70.1,14.99 70.48,14.61 71.25,13.84 JP2.2
AUX_RUN  (via drill 0.6, 0.8)
  Top 0.406: v70.1,20.95 70.61,20.45 71.88,20.45 74.3,18.03 76.45,18.03 114.05,18.03 114.55,18.03 v115.57,19.05
  Bottom 0.406: IC1.14 118.18,21.66 v115.57,19.05 | JP2.3 73.79,12.19 74.42,12.83 74.42,18.67 | 73.66,20.32 74.17,20.32 | 74.17,20.32 74.42,20.07 | 74.42,20.07 74.42,18.67 | U$35.7 70.61,20.45 v70.1,20.95 70.74,20.32 74.17,20.32 | 74.42,18.67 74.42,20.07 | 74.42,20.07 74.17,20.32
AUX_TICK  (via drill 0.6)
  Top 0.406: v115.7,15.88 115.44,15.88 115.06,16.26 72.64,16.26 v72.52,16.38
  Bottom 0.406: IC1.12 119.78,19.96 v115.7,15.88 | U$35.5 72.57,16.43 v72.52,16.38
GND  (via drill 0.6, 0.8)
  Top 0.406: v85.6,99.57 77.47,99.57 73.66,95.76 v71.12,95.76
  Top 1.016: U$38.P$3 128.27,85.09 v129.54,85.09
  Bottom 0.406: 43.18,30.06 R7.1 41.91,31.75 41.91,33.02 40.64,34.29 35.56,34.29 33.02,36.83 OK2.5 33.02,41.49 R10.1 | R306.2 90.8,85.72 90.17,86.36 90.17,87.63 88.9,88.9 | U$1.1 85.98,99.69 v85.6,99.57 | v71.12,95.76 C400.2 | C7.1 112.83,33.42 IC1.21 116.6,33.42 117.35,34.16 119.51,34.16 120.08,33.59 | IC1.5 124.69,32.62 124.97,32.89 124.97,33.91 124.71,34.16 123.73,34.16 IC1.3 123.6,34.29 120.78,34.29 120.08,33.59 | 119.91,33.42 120.08,33.59
  pour Bottom: -6.35,104.14 -3.81,-10.16 148.59,-10.16 148.59,109.22 -3.81,109.22
K_CLK  (via drill 0.6)
  Top 0.406: v76.2,54.61 83.82,54.61 86.36,52.07 88.01,50.42 88.14,50.29 88.39,50.04 88.65,49.78 107.19,49.78 107.31,49.66 107.95,49.02 112.78,44.2 113.54,43.43 114.05,42.93 116.08,42.93 v117.6,42.93
  Bottom 0.406: IC2.2 77.34,55.75 v76.2,54.61 | IC1.28 118.98,41.04 118.98,42.06 118.11,42.93 v117.6,42.93
K_DAT  (via drill 0.6)
  Top 0.406: v116.59,41.66 115.82,41.66 113.92,41.66 111.76,43.81 109.98,45.59 105.66,45.59 104.52,44.45 88.39,44.45 87.5,45.34 83.95,45.34 v72.39,45.34
  Bottom 0.406: IC1.27 118.18,41.33 117.86,41.66 v116.59,41.66 | IC2.9 72.64,48.13 72.39,47.88 v72.39,45.34
K_LOAD  (via drill 0.6)
  Top 0.406: v75.95,56.39 76.2,56.39 77.22,55.37 84.07,55.37 87.88,51.56 88.14,51.31 88.9,50.55 107.82,50.55 108.97,49.4 114.17,44.2 120.27,44.2 v121.67,42.8
  Bottom 0.406: IC2.1 76.58,57.02 v75.95,56.39 | IC1.32 122.18,42.28 v121.67,42.8
KRET1  (3 unrouted)
  Top 0.406: 44.45,77.22 11.18,77.22 11.15,77.19 S1.4 S1.3 | 44.45,77.22 76.96,77.22 | 76.96,77.22 109.98,77.22 110.24,76.96 110.24,74.4 S13.4 | 110.24,67.84 S13.3 | S5.4 44.17,76.94 44.45,77.22 | S9.4 77.19,76.99 76.96,77.22
  Bottom 0.406: 77.22,67.84 S9.3 77.22,67.84 | R17.1 77.69,43.94 77.47,43.94 76.96,43.94 76.2,44.7 76.2,45.21 76.2,46.99 76.2,51.56 76.58,51.94 IC2.5 81.03,51.94 83.57,54.48 83.57,60.45 82.04,61.98 82.04,64.9 81.41,65.53 77.72,65.53 77.22,66.04 77.22,67.84
KRET2  (3 unrouted)
  Top 0.406: 52.58,72.14 20.07,72.14 19.41,72.8 S2.4 19.05,74.02 19.05,73.66 19.41,73.3 S2.3 | 52.58,72.14 85.6,72.14 | 85.6,72.14 118.11,72.14 118.36,72.39 118.47,72.49 S14.4 | S6.4 52.43,72.29 52.58,72.14 | S10.4 85.45,72.29 85.6,72.14
  Bottom 0.406: IC2.6 81.15,50.67 | S10.3 85.45,66.02 84.96,65.53 83.69,65.53 82.93,64.77 82.93,62.23 84.33,60.83 84.45,60.71 84.45,53.98 81.15,50.67 | R18.1 81.79,50.04 81.15,50.67
KRET3  (via drill 0.6, 0.7, 0.8)  (3 unrouted)
  Top 0.406: S3.3 27.66,71.09 27.69,71.12 60.96,71.12 | 60.96,71.12 93.98,71.12 | 93.98,71.12 118.87,71.12 | 118.87,71.12 v120.4,72.64 118.87,71.12 | S7.3 60.68,70.84 60.96,71.12 | S11.3 93.7,70.84 93.98,71.12 | S15.3 S15.4 | v79.88,62.23 82.04,62.23 82.68,62.87 82.68,63.75 83.19,64.26 v93.7,64.26
  Bottom 0.406: IC2.3 81.28,54.48 81.91,55.12 81.91,59.31 79.88,61.34 v79.88,62.23 | 67.82,65.53 64.77,65.53 | 64.77,65.53 61.72,65.53 60.71,66.55 60.71,67.84 S7.3 | R15.1 64.64,65.41 64.77,65.53 | S15.4 126.72,75.72 125.98,76.45 121.16,76.45 120.9,76.45 120.4,75.95 120.4,72.9 v120.4,72.64 | S11.3 93.7,66.04 | 93.7,66.04 v93.7,64.26 | v93.7,64.26 93.7,64.24 | v93.7,64.26 93.7,66.04
KRET4  (via drill 0.6, 0.8)  (3 unrouted)
  Top 0.406: S12.3 101.96,65.89 101.6,65.53 | 71.12,65.53 70.61,65.53 | S8.3 68.94,65.68 69.09,65.53 70.1,65.53 | 70.1,65.53 71.12,65.53 | S4.3 35.92,65.94 36.32,65.53 70.1,65.53 | v112.01,65.53 101.6,65.53 | S16.3 S16.4 | v81.03,63.5 81.03,65.28 81.28,65.53 | 71.12,65.53 81.28,65.53 | 81.28,65.53 101.6,65.53
  Bottom 0.406: S16.3 134.98,66.9 133.86,65.79 133.6,65.53 v112.01,65.53 | R16.1 75.18,44.66 75.18,45.97 75.18,52.58 75.82,53.21 IC2.4 81.03,53.21 82.68,54.86 82.68,59.94 81.03,61.59 v81.03,63.5
KRET5  (via drill 0.6)
  Top 0.406: v66.29,59.64 MSW9.2 MSW9.1 MSW5.2 MSW5.1 | v66.29,59.64 71.12,59.64 | 71.12,59.64 MSW13.1 MSW13.2 | v66.29,59.64 71.12,59.64
  Bottom 0.406: IC2.14 67.18,54.48 66.29,55.37 66.29,56.9 66.29,57.15 66.29,57.66 | 66.29,57.66 66.29,59.38 v66.29,59.64 | R19.1 66.25,57.62 66.29,57.66
KRET6  (via drill 0.6)
  Top 0.406: 63.5,46.3 MSW10.2 MSW10.1 MSW6.2 MSW6.1 | 63.5,46.3 v66.29,46.3 | v66.29,46.3 MSW14.1 MSW14.2 | v66.29,46.3 63.5,46.3
  Bottom 0.406: IC2.13 67.18,53.21 66.29,52.32 66.29,50.8 | 66.29,50.8 v66.29,46.3 | R14.1 66.25,50.76 66.29,50.8
KRET7  (via drill 0.6)
  Top 0.406: 68.33,32.97 MSW15.1 MSW15.2 | 68.33,32.97 v67.31,32.97 | v67.31,32.97 MSW11.2 MSW11.1 48.26,33.07 48.26,35.31 40.89,42.67 24.64,42.67 18.95,36.98 MSW7.2 MSW7.1 | v67.31,32.97 68.33,32.97 | MSW15.2 102.82,32.97 102.87,33.02 102.82,33.02 MSW15.2
  Bottom 0.406: IC2.12 67.94,51.94 67.31,51.31 67.31,43.94 67.31,43.43 | 67.31,43.43 67.31,39.37 67.31,33.22 v67.31,32.97 | R20.1 67.09,43.65 67.31,43.43
KRET8  (via drill 0.6, 0.8)  (1 unrouted)
  Top 0.406: v90.42,24 84.58,24 83.95,23.37 83.31,22.73 68.96,22.73 v68.33,22.73 61.09,22.73 60.86,22.5 MSW12.2 MSW12.1 MSW8.2 MSW8.1 | MSW4.2 MSW4.1 | v90.42,19.79 102.62,19.79 MSW16.2
  Bottom 0.406: MSW8.2 19.74,19.63 21.59,17.78 21.59,10.01 MSW4.1 | IC2.11 68.96,50.67 68.33,50.04 68.33,44.45 68.33,43.69 | 68.33,43.69 68.33,41.91 68.33,23.62 v68.33,22.73 | R21.1 68.36,43.65 68.33,43.69 | v90.42,19.79 90.42,22.73 v90.42,24
KSCAN1  (via drill 0.6, 0.7)
  Top 0.406: v9.4,43.94 9.91,43.94 39.37,43.94 40.89,43.94 46.23,38.61 47.75,37.08 59.94,37.08 60.83,36.58 101.98,36.58 v112.27,36.58
  Bottom 0.406: 10.16,70.36 8.89,70.36 8.89,70.35 U$2.C 8.89,69.86 8.89,69.85 | 10.16,70.36 16.67,70.36 U$3.C 17.15,70.24 17.27,70.36 25.4,70.36 | 25.4,70.36 33.18,70.36 U$5.C 34.26,69.88 34.29,69.85 | U$4.C 25.41,70.35 25.4,70.36 | 3.94,43.94 3.94,69.09 4.57,70.1 9.91,70.1 10.16,70.36 | 113.82,35.02 IC1.23 114.99,34.92 112.9,34.92 112.27,35.56 v112.27,36.58 | v9.4,43.94 3.94,43.94 | 3.94,43.94 3.94,11.3 4.7,10.54 14.99,10.54 15.88,9.65 U$21.C
KSCAN2  (via drill 0.6, 0.7, 0.8)
  Top 0.406: v41.4,63.75 36.32,63.75 34.54,65.53 19.3,65.53 v15.75,61.98 | v85.34,63.12 85.09,63.37 83.69,63.37 83.57,63.25 83.57,62.1 82.42,60.96 v70.87,60.96 | v85.34,31.24 113.28,31.24 114.81,32.77 v114.81,37.08
  Bottom 0.406: 15.75,31.75 15.75,20.32 15.08,19.65 U$25.C | 15.75,31.75 15.75,33.02 | 15.75,33.02 15.75,44.96 15.75,46.48 | 15.75,46.48 15.75,58.42 | 15.75,58.42 15.75,59.69 | 15.75,59.69 15.75,61.47 v15.75,61.98 15.75,59.69 | 15.72,58.39 15.75,58.42 | 15.72,31.72 15.75,31.75 | U$6.C 41.92,70.35 41.91,70.36 50.8,70.36 | 50.8,70.36 58.42,70.36 | 58.42,70.36 66.2,70.36 U$9.C 66.68,70.24 66.8,70.36 70.61,70.36 70.87,70.1 v70.87,60.96 | U$8.C 58.43,70.35 58.42,70.36 | U$7.C 50.32,69.88 50.8,70.36 | U$6.C 41.92,69.86 41.91,69.85 | U$6.C 41.91,66.29 41.91,64.26 v41.4,63.75 | U$22.C 15.72,59.66 15.75,59.69 | U$24.C 15.72,32.99 15.75,33.02 | U$23.C 15.59,46.32 15.75,46.48 | v85.34,31.24 85.34,59.82 85.34,60.2 v85.34,63.12 | v114.81,37.08 114.81,36.1 IC1.24
KSCAN3  (via drill 0.6, 0.7)
  Top 0.406: v58.42,64.01 73.66,64.01 | 73.66,64.01 v74.93,64.01 73.66,64.01 | v116.33,39.5 116.33,40.13 115.82,40.64 113.54,40.64 111.25,42.93 v110.11,44.07
  Bottom 0.406: U$29.C 56.61,18.51 57.15,19.05 57.15,31.75 | 57.15,31.75 57.15,45.21 | 57.15,45.21 57.15,58.42 | 57.15,58.42 57.15,60.71 57.15,62.74 v58.42,64.01 | U$26.C 57.12,58.39 57.15,58.42 | U$27.C 57.12,45.18 57.15,45.21 | U$28.C 57.12,31.72 57.15,31.75 | 83.82,70.36 74.93,70.36 74.94,70.35 U$10.C 74.94,69.86 | 83.82,70.36 91.44,70.36 | 91.44,70.36 99.22,70.36 U$13.C 99.7,65.15 100.84,64.01 104.9,64.01 105.41,63.5 105.41,45.21 106.05,44.58 109.6,44.58 v110.11,44.07 | U$12.C 91.44,70.35 91.44,70.36 | U$11.C 83.34,69.88 83.82,70.36 | 74.94,69.86 74.93,69.85 | 74.94,69.86 v74.94,64.01 v74.93,64.01 | IC1.25 116.58,39.25 v116.33,39.5
KSCAN4  (via drill 0.8)
  Top 0.406: v99.06,62.23 99.06,62.74 100.46,64.14 v106.93,64.14
  Bottom 0.406: 116.84,70.36 107.95,70.36 107.95,70.35 U$14.C 107.95,64.77 107.31,64.14 v106.93,64.14 | 116.84,70.36 124.46,70.36 | 124.46,70.36 132.24,70.36 U$17.C | U$16.C 124.46,70.35 124.46,70.36 | U$15.C 116.36,69.88 116.84,70.36 | U$33.C 94.01,18.26 93.22,19.05 93.22,31.75 | 93.22,31.75 93.22,36.83 93.22,39.37 93.22,44.96 | 93.22,44.96 93.22,57.91 93.73,58.42 99.02,58.42 U$30.C v99.05,62.23 v99.06,62.23 | 93.22,44.96 93.44,45.18 U$31.C 100.49,45.18 100.96,44.7 100.96,43.81 101.22,43.56 108.71,43.56 109.85,42.42 113.28,42.42 115.06,40.64 117.09,40.64 117.38,40.35 IC1.26 | U$32.C 93.25,31.72 93.22,31.75
MOSI  (via drill 0.6)
  Top 0.406: v78.74,96.01 76.2,96.01 74.93,94.74 74.93,85.6 74.93,84.33 71.88,81.28 71.63,81.03 8.89,81.03 7.75,81.03 3.94,77.22 3.94,13.46 3.94,11.3 4.7,10.54 14.86,10.54 17.02,12.7 20.45,12.7 22.22,14.48 22.61,14.48 39.12,14.48 43.18,10.41 44.45,9.14 44.45,6.6 44.45,6.22 44.83,5.84 45.34,5.33 96.52,5.33 98.81,7.62 98.81,11.43 99.95,12.57 104.52,12.57 106.93,14.99 113.92,14.99 v114.3,14.99
  Bottom 0.406: U$1.5 80.14,94.61 v78.74,96.01 | IC1.15 117.38,25.4 | 117.38,25.4 117.38,24.92 116.59,24.13 U$34.4 | v114.3,14.99 114.3,19.05 117.35,22.1 117.35,25.37 117.38,25.4
N$1
  Bottom 0.406: L1.CA 71.12,81.92 75.56,81.92 76.2,82.55 76.2,92.08 77.47,93.34 U$1.6
N$2
  Bottom 0.406: U$1.7 78.1,92.08 77.47,91.44 77.47,80.01 L2.CA
N$3
  Bottom 0.406: U$1.8 79.38,90.81 78.74,90.17 78.74,81.92 79.38,81.28 81.91,81.28 L3.CA
N$4
  Bottom 0.406: U$1.9 85.09,89.53 88.9,85.72 88.9,84.45 89.53,83.82 93.98,83.82 94.61,83.19 101.6,83.19 102.23,82.55 109.22,82.55 109.85,81.92 116.84,81.92 117.47,81.28 124.46,81.28 125.09,80.64 132.08,80.64 L4.CA
N$5
  Bottom 0.406: U$1.10 85.09,88.27 88.27,85.09 88.27,83.82 88.9,83.19 93.34,83.19 93.98,82.55 100.96,82.55 101.6,81.92 108.58,81.92 109.22,81.28 116.2,81.28 116.84,80.64 123.83,80.64 L5.CA
N$6
  Bottom 0.406: U$1.11 85.09,87 87.63,84.45 87.63,83.19 88.27,82.55 92.71,82.55 93.34,81.92 100.33,81.92 100.96,81.28 107.95,81.28 108.58,80.64 115.57,80.64 L6.CA
N$7
  Bottom 0.406: U$1.12 85.09,85.72 86.99,83.82 86.99,82.55 87.63,81.92 92.08,81.92 92.71,81.28 99.69,81.28 100.33,80.64 107.31,80.64 L7.CA
N$8
  Bottom 0.406: U$1.13 85.09,84.45 86.36,83.19 86.36,81.92 86.99,81.28 91.44,81.28 92.08,80.64 99.06,80.64 L8.CA
N$9
  Bottom 0.406: U$1.14 85.09,83.19 85.72,82.55 85.72,81.28 86.36,80.64 90.8,80.64 L9.CA
N$10  (via drill 0.8)
  Top 0.406: v13.46,8.64 13.46,7.75 14.35,6.86 16,6.86 36.2,6.86 36.7,6.35 36.7,4.32 37.59,3.43 97.03,3.43 99.31,5.71 L18.CA
  Bottom 0.406: U$1.23 71.12,93.34 63.5,85.72 56.52,85.72 55.88,85.09 48.9,85.09 48.26,84.45 41.28,84.45 40.64,83.82 33.66,83.82 33.02,83.19 26.04,83.19 25.4,82.55 18.41,82.55 17.78,81.92 7.49,81.92 2.29,76.71 2.29,74.68 2.29,10.16 3.81,8.64 v13.46,8.64
N$11  (via drill 0.6)
  Top 0.406: L17.CA 38.48,5.84 36.7,7.62 16.76,7.62 16.51,7.62 14.99,7.62 14.86,7.75 v14.86,8.64
  Bottom 0.406: U$1.22 71.12,92.08 64.14,85.09 57.15,85.09 56.52,84.45 49.53,84.45 48.9,83.82 41.91,83.82 41.28,83.19 34.29,83.19 33.66,82.55 26.67,82.55 26.04,81.92 19.05,81.92 18.41,81.28 8,81.28 3.17,76.45 3.17,75.56 3.17,10.67 4.19,9.65 14.48,9.65 14.86,9.27 v14.86,8.64
N$12
  Bottom 0.406: U$1.21 71.12,90.81 64.77,84.45 57.79,84.45 57.15,83.82 50.17,83.82 49.53,83.19 42.55,83.19 41.91,82.55 34.93,82.55 34.29,81.92 27.3,81.92 26.67,81.28 19.68,81.28 19.05,80.64 12.06,80.64 L16.CA
N$13
  Bottom 0.406: U$1.20 71.12,89.53 65.41,83.82 58.42,83.82 57.79,83.19 50.8,83.19 50.17,82.55 43.18,82.55 42.55,81.92 35.56,81.92 34.93,81.28 27.94,81.28 27.3,80.64 20.32,80.64 L15.CA
N$14
  Bottom 0.406: U$1.19 71.12,88.27 66.04,83.19 59.05,83.19 58.42,82.55 51.44,82.55 50.8,81.92 43.82,81.92 43.18,81.28 36.2,81.28 35.56,80.64 28.57,80.64 L14.CA
N$15
  Bottom 0.406: U$1.18 71.12,87 66.67,82.55 59.69,82.55 59.05,81.92 52.07,81.92 51.44,81.28 44.45,81.28 43.82,80.64 36.83,80.64 L13.CA
N$16
  Bottom 0.406: U$1.17 71.12,85.72 67.31,81.92 60.33,81.92 59.69,81.28 52.71,81.28 52.07,80.64 45.09,80.64 L12.CA
N$17
  Bottom 0.406: U$1.16 71.12,84.45 67.94,81.28 60.96,81.28 60.33,80.64 53.34,80.64 L11.CA
N$18
  Bottom 0.406: U$1.15 71.12,83.19 68.58,80.64 61.6,80.64 L10.CA
N$19
  Top 0.406: S1.1 S1.2
  Bottom 0.406: S1.2 6.91,74.37 U$2.A
N$20
  Top 0.406: S2.1 S2.2
  Bottom 0.406: S2.2 15.16,74.37 U$3.A
N$21
  Bottom 0.406: U$1.3 85.47,97.16 86.11,96.52 87.03,96.52 R1.2
N$22  (1 unrouted)
  Bottom 0.406: S3.2 23.42,74.37 U$4.A
N$23  (1 unrouted)
  Bottom 0.406: S4.2 31.67,74.37 U$5.A
N$24  (1 unrouted)
  Bottom 0.406: S5.2 39.93,74.37 U$6.A
N$25  (1 unrouted)
  Bottom 0.406: S6.2 48.18,74.37 U$7.A
N$26  (1 unrouted)
  Bottom 0.406: S7.2 56.44,74.37 U$8.A
N$27  (1 unrouted)
  Bottom 0.406: S8.2 64.69,74.37 U$9.A
N$28  (1 unrouted)
  Bottom 0.406: S9.2 72.95,74.37 U$10.A
N$29  (1 unrouted)
  Bottom 0.406: S10.2 81.2,74.37 U$11.A
N$30  (1 unrouted)
  Bottom 0.406: S11.2 89.46,74.37 U$12.A
N$31  (1 unrouted)
  Bottom 0.406: S12.2 97.71,74.37 U$13.A
N$32  (1 unrouted)
  Bottom 0.406: S13.2 105.97,74.37 U$14.A
N$33  (1 unrouted)
  Bottom 0.406: S14.2 114.22,74.37 U$15.A
N$34
  Top 0.406: S15.1 S15.2
  Bottom 0.406: S15.2 122.48,74.37 U$16.A
N$35
  Top 0.406: S16.1 S16.2
  Bottom 0.406: S16.2 130.73,74.37 U$17.A
N$36
  Top 0.406: MSW13.3 MSW13.4
  Bottom 0.406: MSW13.4 100.28,54.66 U$30.A
N$38
  Top 0.406: MSW14.3 MSW14.4
  Bottom 0.406: MSW14.4 100.66,41.33 U$31.A
N$39
  Top 0.406: MSW16.3 MSW16.4
  Bottom 0.406: MSW16.4 100.16,14.66 U$33.A
N$40
  Top 0.406: MSW15.3 MSW15.4
  Bottom 0.406: MSW15.4 100.28,27.99 U$32.A
N$43
  Top 0.406: MSW4.3 MSW4.4
  Bottom 0.406: U$21.A 21.01,4.45 MSW4.3
N$44  (via drill 0.8)
  Top 0.406: MSW5.3 v13.97,54.66 | v13.97,54.66 15.24,54.66 | 15.24,54.66 MSW5.4 | v13.97,54.66 15.24,54.66
  Bottom 0.406: U$22.A 13.97,55.88 13.97,54.86 v13.97,54.66
N$45  (via drill 0.8)
  Top 0.406: MSW6.3 v13.97,41.33 | v13.97,41.33 15.24,41.33 | 15.24,41.33 MSW6.4 | v13.97,41.33 15.24,41.33
  Bottom 0.406: U$23.A 13.97,41.66 v13.97,41.33
N$46  (via drill 0.8)
  Top 0.406: MSW7.3 v13.97,27.99 | v13.97,27.99 15.24,27.99 | 15.24,27.99 MSW7.4 | v13.97,27.99 15.24,27.99
  Bottom 0.406: U$24.A v13.96,28 v13.97,27.99
N$47  (via drill 0.8)
  Top 0.406: MSW8.3 13.39,14.66 v13.97,14.66 | v13.97,14.66 15.24,14.66 | 15.24,14.66 MSW8.4 | v13.97,14.66 15.24,14.66
  Bottom 0.406: U$25.A 13.97,15.24 v13.97,14.66
N$48
  Top 0.406: MSW9.4 MSW9.3
  Bottom 0.406: MSW9.3 50.84,54.66 U$26.A
N$49
  Top 0.406: MSW10.4 MSW10.3
  Bottom 0.406: MSW10.3 50.71,41.33 U$27.A
N$50
  Top 0.406: MSW11.4 MSW11.3
  Bottom 0.406: MSW11.3 50.84,27.99 U$28.A
N$51
  Top 0.406: MSW12.4 MSW12.3
  Bottom 0.406: MSW12.3 50.71,14.66 U$29.A
N$52
  Bottom 0.406: IC1.7 125.44,31.02 127.76,28.7 | 127.76,28.7 Q1.2 | C401.2 128.18,28.28 127.76,28.7
N$53
  Bottom 0.406: IC1.8 124.97,30.22 125.73,29.46 125.73,24.26 Q1.1 128.49,21.5 C402.2
N$54
  Bottom 0.406: R2.1 130.21,8.29 PWR.AN
N$55
  Bottom 0.406: R3.1 111.16,8.29 RX.AN
N$56
  Bottom 0.406: R4.1 117.51,8.29 TX.AN
N$57
  Bottom 0.406: OUT4.1 R12.1
N$58
  Bottom 0.406: IC1.16 112.8,28.73 111.76,27.69 111.76,25.65 112.01,25.4 U$34.5
N$60
  Bottom 0.406: OUT5.1 R13.1
N$61
  Bottom 0.406: JP1.1 C403.2
N$62
  Bottom 0.406: AUX4.1 R5.1
N$63
  Bottom 0.406: U$36.A 32.39,53.34 32.38,53.35 | OK1.2 38.1,46.99 38.1,51.82 37.85,52.07 32.77,52.07 32.38,52.45 32.38,53.35 | R5.2 32.38,53.35
N$64
  Bottom 0.406: OK1.3 40.64,38.86 38.86,40.64 38.86,52.32 38.1,53.09 35.05,53.09 34.89,53.24 U$36.C 34.89,61.69 AUX5.1
N$65
  Bottom 0.406: JP2.6 81.41,11.43 77.09,15.75 77.09,17.91 U$35.4
N$66
  Bottom 0.406: R9.1 IN4.1
N$67
  Bottom 0.406: R9.2 U$37.A 24.77,52.7 27.94,49.53 OK2.2
N$68
  Bottom 0.406: OK2.3 30.48,49.53 27.27,52.74 U$37.C 27.27,61.69 IN5.1
N$70
  Bottom 0.406: OK1.7 38.1,30.48 39.37,31.75 R7.2
N$71  (via drill 0.8)
  Top 0.406: OK1.6 40.64,26.67 43.43,23.88 44.07,23.24 58.29,23.24 58.93,23.88 59.18,24.13 v80.26,24.13
  Bottom 0.406: R6.2 39.37,25.4 40.64,26.67 OK1.6 | U$35.2 79.38,20.45 80.39,21.46 80.39,24 v80.26,24.13
N$72
  Bottom 0.406: OK2.7 27.94,41.49 R10.2
N$73
  Bottom 0.406: U$35.3 81.62,19.18 R8.1
N$74
  Bottom 0.406: R8.2 81.66,17.02 80.64,16 80.64,14.64 LED1.A
N$83
  Top 0.406: U$19.TIP U$19.TIP_NC 111.25,93.22 110.49,93.98 102.87,93.98 101.6,92.71 101.09,92.2 U$18.TIP
  Bottom 0.406: R308.2 103.38,88.39 101.09,90.68 U$18.TIP
N$84
  Bottom 0.406: C301.1 100.58,88.07 R304.2 98.04,90.93 U$18.TIP_NC
N$85  (via drill 0.6)
  Top 0.406: v98.04,84.33 98.04,82.55 99.06,81.53 104.14,81.53 127.51,81.53 127.63,81.53 128.78,80.39 128.78,77.6 129.92,76.45 135.76,76.45 137.67,74.55 137.67,57.66 136.4,56.39 v131.83,56.39
  Bottom 0.406: v98.04,84.33 R304.1 | IC3.10 130.43,51.44 130.81,51.82 130.81,56.13 131.06,56.39 v131.83,56.39
N$86
  Bottom 0.406: IC3.12 IC3.11
N$87
  Bottom 0.406: IC3.13 127.25,55.24 123.19,51.18 R302.2
N$88  (via drill 0.6)
  Top 0.406: 129.79,63.5 129.79,64.77 129.03,65.53 129.03,65.79 129.03,76.2 128.02,77.22 128.02,80.01 127.25,80.77 98.3,80.77 96.52,82.55 96.52,89.66 96.01,90.17 93.47,90.17 U$18.RING_NC | 129.79,63.5 129.79,61.21 | 129.79,61.21 129.79,63.5 | v132.59,58.93 130.81,58.93 129.79,59.94 129.79,61.21
  Bottom 0.406: R307.1 v132.59,58.93
N$89
  Bottom 0.406: U$18.RING 90.93,88.2 R305.1 92.01,87.56 92.96,86.61 92.96,85.79 R306.1
N$90  (via drill 0.6)
  Top 0.406: v128.27,62.74 128.27,65.79 128.27,75.69 127.25,76.71 127.25,79.5 127,79.76 126.75,80.01 125.22,80.01 97.54,80.01 95.25,82.3 v95.25,85.6
  Bottom 0.406: 135.03,56.39 IC3.1 135.38,56.74 135.38,62.23 134.62,62.74 v128.27,62.74 | v95.25,85.6 95.25,87.38 94.49,88.14 R305.2
N$91  (via drill 0.6)
  Top 0.406: EXT_CLK.CA 126.24,5.71 127.38,6.86 127.38,15.11 128.02,15.75 131.19,15.75 131.45,16 131.45,19.05 138.05,25.65 138.05,43.31 v136.78,44.58
  Bottom 0.406: v136.78,44.58 136.78,50.16 | 136.78,50.16 136.78,53.59 136.4,53.98 IC3.3 | IC3.6 136.78,50.16
N$92  (via drill 0.6)
  Top 0.406: 105.16,84.07 v105.16,85.85 105.16,82.55 105.41,82.3 128.02,82.3 129.67,80.64 129.67,77.98 129.79,77.85 130.43,77.22 136.27,77.22 138.43,75.06 138.43,74.17 138.43,57.15 136.91,55.63 134.37,55.63 133.35,54.61 v133.35,51.31
  Bottom 0.406: R308.1 103.82,85.92 v105.16,85.85 | IC3.5 133.48,51.44 v133.35,51.31
N$93
  Bottom 0.406: IC3.4 132.72,52.7 132.33,52.32 132.33,48.51 133.1,47.75 133.1,46.8 R301.2
N$94  (via drill 0.8)
  Top 0.406: v130.05,14.48 131.95,14.48 132.46,14.99 132.46,18.8 138.81,25.15 138.81,47.5 136.65,49.66 v131.32,49.66
  Bottom 0.406: IC3.9 130.18,50.16 | IC3.2 131.7,55.24 131.57,55.12 131.57,51.56 130.18,50.16 | v131.32,49.66 130.68,49.66 130.18,50.16 | R303.1 125.66,13.78 126.36,14.48 v130.05,14.48
N$95
  Bottom 0.406: EXT_CLK.AN 123.83,10.99 R303.2
N$96
  Bottom 0.406: IC3.8 126.18,48.9 R300.2
N$98
  Top 1.016: U$20.RING_SW 137.95,95.41 138.3,95.76 BATT-.1
N$100  (via drill 0.6)
  Top 1.016: U$20.TIP 128.67,87.23 127,88.9 127,91.44 125.73,92.71 118.11,92.71 116.84,91.44 116.84,86.36 115.57,85.09 v114.3,85.09
  Bottom 1.016: v114.3,85.09 B1.AC2 | BATT+.1 130.05,98.3 128.91,97.16 128.91,89.52 131.19,87.23 U$20.TIP
N$101
  Bottom 1.016: B1.- 117.3,83.36 118.11,82.55 125.73,82.55 127,83.82 127,86.36 125.73,87.63 U$38.P$2
N$102
  Bottom 1.016: B1.+ U$38.P$5
N$105  (via drill 0.6)
  Top 1.016: U$38.P$4 120.65,83.82 121.03,83.44 128.52,83.44 130.94,81.03 131.19,80.77 135.89,80.77 136.53,80.14 136.78,79.76 v136.78,78.23
  Bottom 1.016: C11.2 112.86,55.46 113.03,55.63 U1.2 113.03,59.44 C13.+ 110.24,62.74 111.51,64.26 134.87,64.26 136.65,66.17 136.78,66.29 v136.78,78.23
N$106  (via drill 0.6)
  Top 1.016: U$20.RING 127.85,93.13 127,93.98 117.6,93.98 115.82,92.2 115.57,91.95 115.57,88.14 115.06,87.63 v114.3,87.63
  Bottom 1.016: v114.3,87.63 B1.AC1
RESET  (via drill 0.6, 0.8)
  Top 0.406: v111.76,20.32 116.08,20.32 119.89,24.13 v119.89,35.56 | 119.89,36.32 v119.89,35.56 | 120.65,37.47 120.33,37.15 | 120.33,37.15 119.89,36.7 v119.89,35.56 | v123.7,37.97 121.16,37.97 120.33,37.15
  Bottom 0.406: U$34.1 112.01,22.86 111.76,22.61 v111.76,20.32 | v119.89,35.56 119.89,37.2 IC1.29 | 131.32,39.33 C403.1 129.79,39.37 128.4,37.97 v123.7,37.97
RX_LED
  Bottom 0.406: IC1.11 120.58,18.8 120.58,18.77 R3.2
RXD  (via drill 0.6, 0.7)
  Top 0.406: OK2.6 30.48,34.29 31.75,33.02 40.64,33.02 41.91,31.75 41.91,26.92 43.94,24.89 44.7,24.13 57.91,24.13 58.67,24.89 59.44,25.65 75.95,25.65 91.69,25.65 92.96,24.38 99.82,24.38 108.46,24.38 108.84,24.77 108.84,26.8 110.74,28.7 112.78,28.7 114.3,28.7 115.95,28.7 116.33,29.08 116.33,30.73 116.33,31.88 118.49,34.04 118.49,37.21 118.49,37.47 v120.14,39.12 | v124.59,39.12 v120.14,39.12 | v120.14,39.12 120.4,39.12
  Bottom 0.406: R11.2 29.21,36.83 30.48,38.1 | 30.48,38.1 OK2.6 30.48,38.1 | 120.65,37.38 IC1.30 120.65,37.38 | JP1.3 137.54,34.29 137.92,34.67 137.92,40.39 137.16,41.15 129.92,41.15 129.48,40.7 | 129.48,40.7 129.29,40.51 | v124.59,39.12 127.89,39.12 129.48,40.7 | 120.65,37.38 120.65,38.61 v120.14,39.12
SCK  (via drill 0.6)
  Top 0.406: v78.74,97.54 76.71,97.54 74.17,95 74.17,86.11 74.17,84.84 71.12,81.79 8.13,81.79 7.37,81.79 3.43,77.85 | v117.86,30.73 117.86,27.94 | 117.86,27.94 117.86,26.92 v116.33,25.4 | v109.73,23.62 109.73,24.64 109.73,26.54 111.12,27.94 113.03,27.94 117.86,27.94 | v107.44,13.84 107.06,13.84 104.9,11.68 100.2,11.68 99.57,11.05 99.57,7.24 96.77,4.45 44.7,4.45 43.43,5.71 43.43,8.64 42.42,9.65 38.61,13.46 22.48,13.46 20.7,11.68 17.4,11.68 15.37,9.65 4.32,9.65 3.17,10.79 3.17,76.83 3.17,77.6 3.43,77.85 | 3.43,77.85 3.3,77.72
  Bottom 0.406: U$1.4 80.39,95.89 v78.74,97.54 | IC1.17 117.34,30.22 v117.86,30.73 | v116.33,25.4 U$34.6 | v109.73,23.62 108.71,22.61 107.44,21.34 v107.44,13.84
TX_LED
  Bottom 0.406: IC1.10 121.38,18.29 119.21,16.12 R4.2
TXD  (via drill 0.8)
  Top 0.406: v43.43,43.94 83.31,43.94 87.63,39.62 89.79,37.47 110.87,37.47 111.76,38.35 112.52,38.35 117.09,38.35 117.35,38.61 117.35,40.39 117.98,41.02 v120.52,41.02
  Bottom 0.406: R12.2 42.55,44.83 v43.43,43.94 | v120.52,41.02 121.28,41.02 121.41,40.89 121.41,37.34 IC1.31 121.41,37.28 121.41,35.94 121.54,35.81 122.17,35.81 123.19,36.83 JP1.2
XCLK_DETECT  (via drill 0.6)
  Top 0.406: v123.19,25.91 123.19,27.94 123.19,33.02 124.08,33.91 126.49,33.91 127,34.42 v127,43.18
  Bottom 0.406: IC1.9 122.18,26.92 v123.19,25.91 | v127,43.18 127,45.79 R300.1
XCLK_RECV  (via drill 0.8)
  Top 0.406: v130.81,44.45 129.54,44.45 128.27,43.18 128.27,36.32 v128.27,35.81
  Bottom 0.406: R301.1 130.81,46.42 v130.81,44.45 | v128.27,35.81 127.5,35.82 127.13,36.2 124.33,36.2 123.96,35.82 IC1.1
XCLK_SEND  (via drill 0.8)
  Top 0.406: v125.73,35.05 v125.73,41.66
  Bottom 0.406: R302.1 123.67,46.32 125.73,44.26 v125.73,41.66 | IC1.2 125.13,35.02 125.7,35.02 v125.73,35.05
(copper drawn outside any net)
  shapes: Bottom area x1